# EAGLE schematic Star Motherboard V4 (EAGLE 9.6.2)

## Sheet 1 of 8: ICU- LPC1769/ VIN
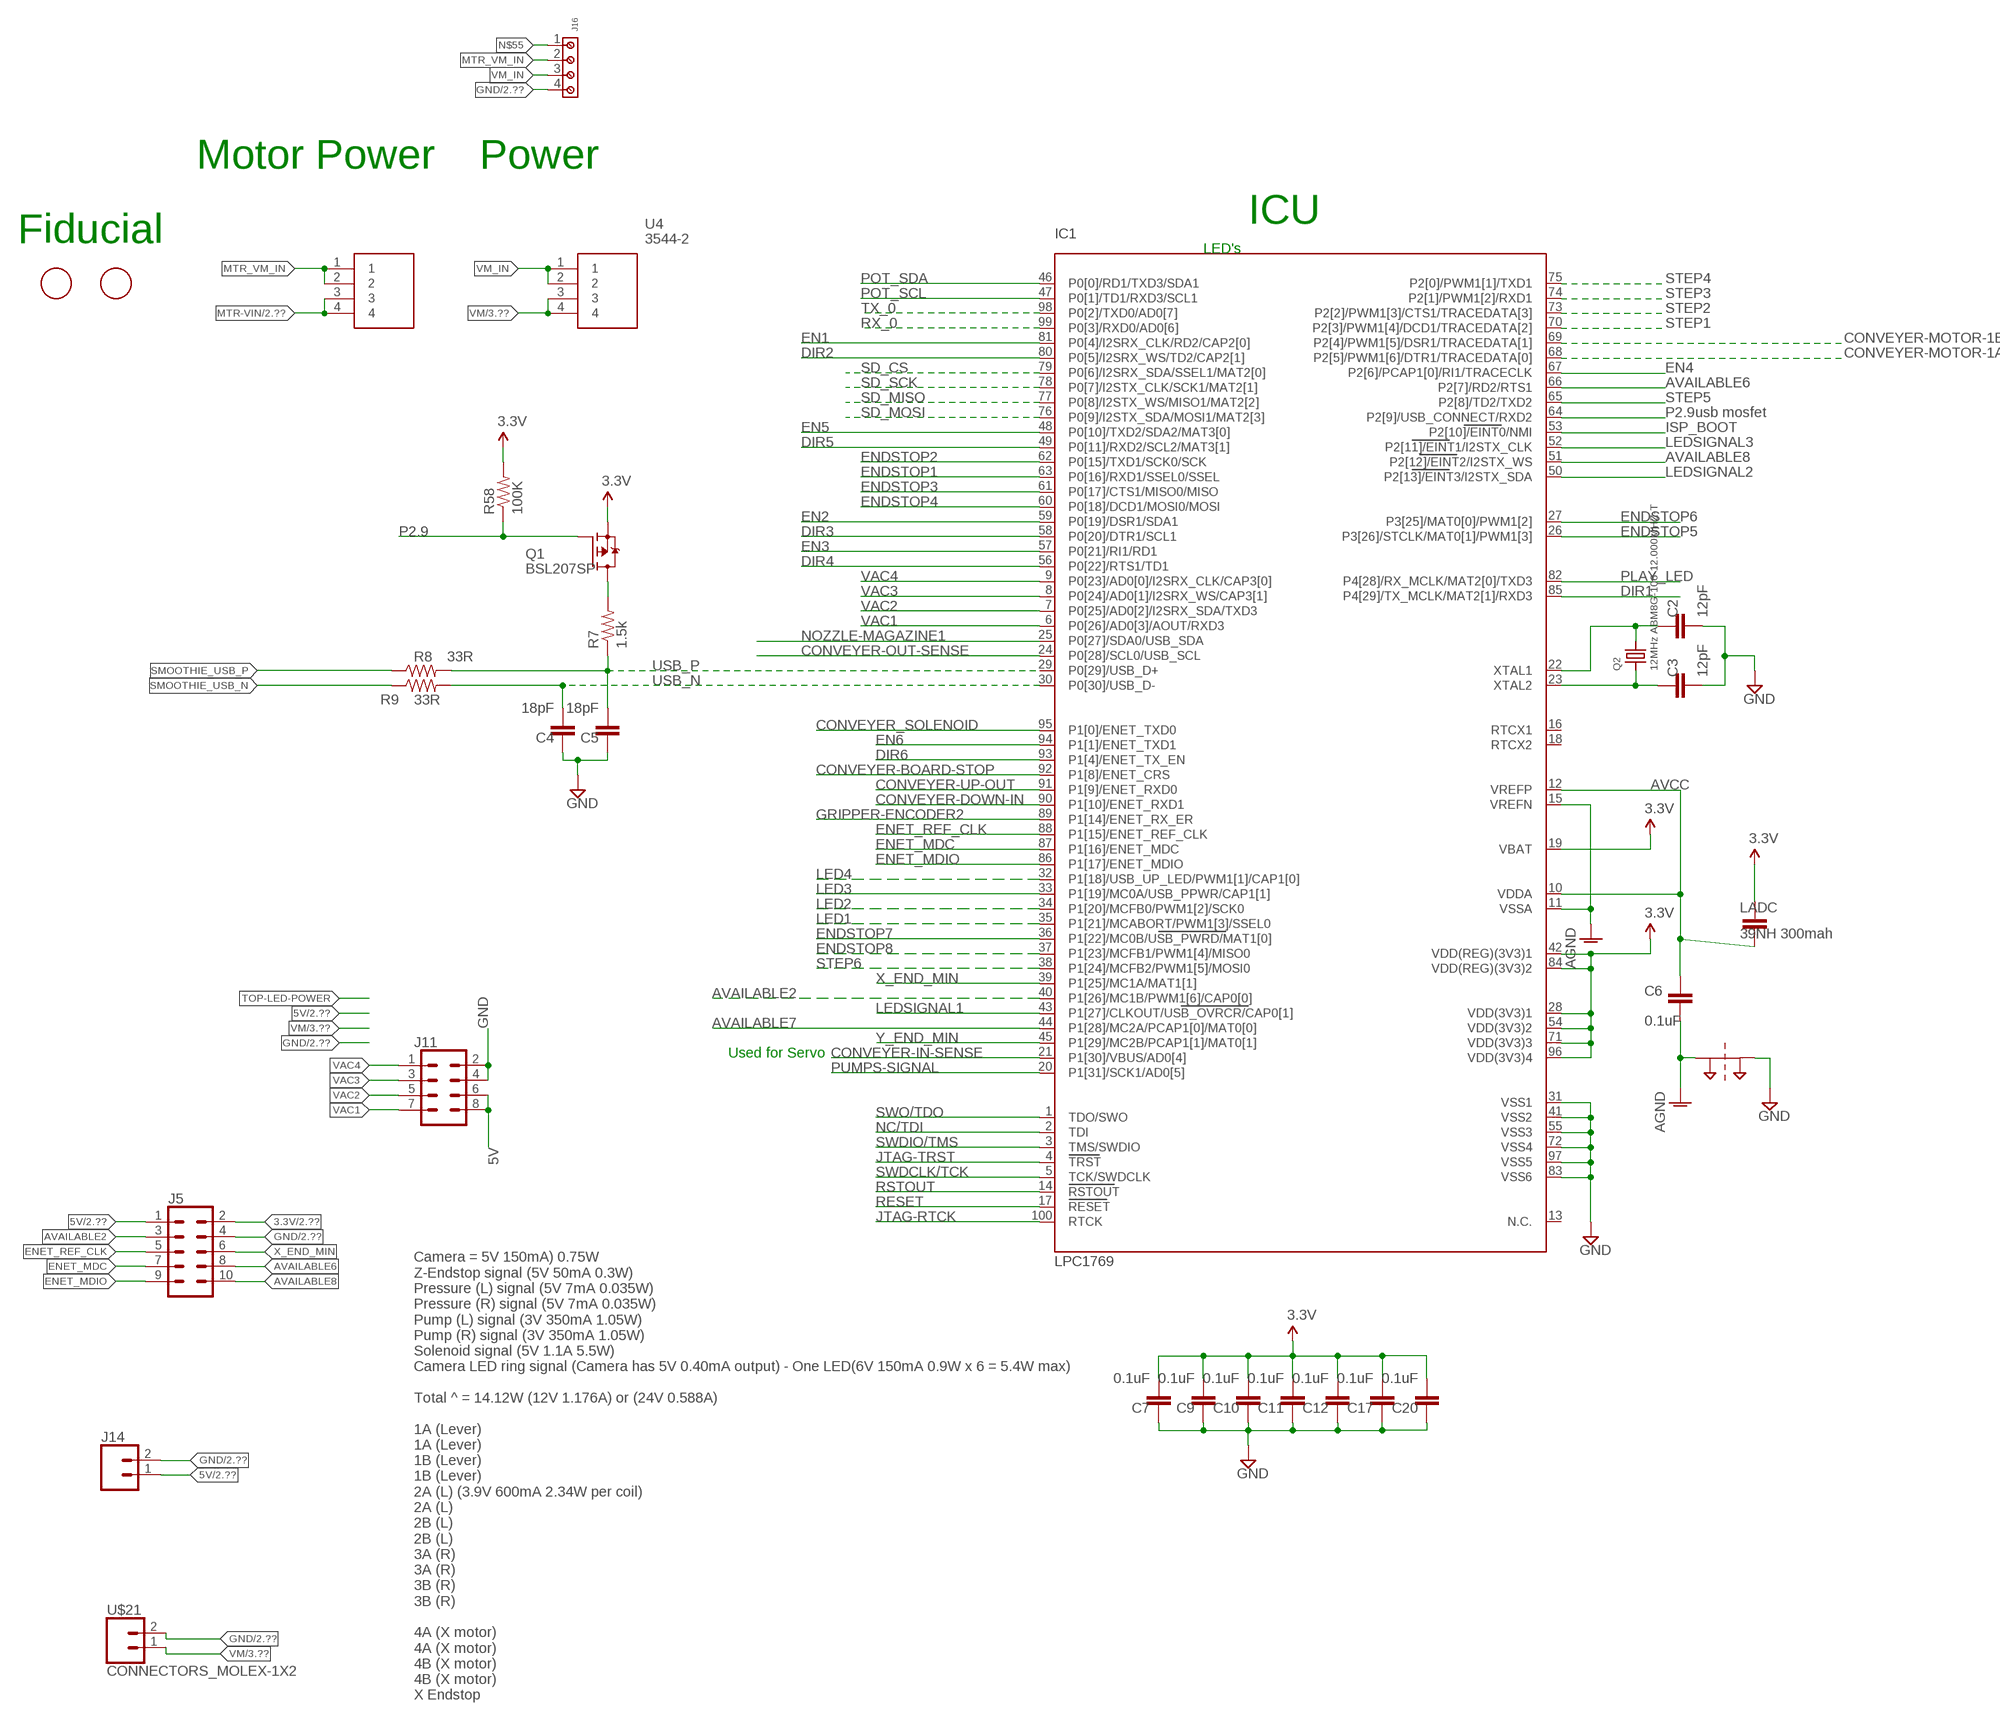
[diagram p0: schematic, sheet 1]

### Parts
C2  12pF  CAP_0603  [CAP_0603]
C3  12pF  CAP_0603  [CAP_0603]
C4  18pF  CAP_0603  [CAP_0603]
C5  18pF  CAP_0603  [CAP_0603]
C6  0.1uF  CAP_0603  [CAP_0603]
C7  0.1uF  CAP_0603  [CAP_0603]
C9  0.1uF  CAP_0603  [CAP_0603]
C10  0.1uF  CAP_0603  [CAP_0603]
C11  0.1uF  CAP_0603  [CAP_0603]
C12  0.1uF  CAP_0603  [CAP_0603]
C17  0.1uF  CAP_0603  [CAP_0603]
C20  0.1uF  CAP_0603  [CAP_0603]
IC1  LPC1769  [LPC1769]
J5  CONN_05X2PTH  [2X5]
J11  CONN_04X2  [2X4]
J14  CONN_02  [1X02]
J16  691137710004  [691137710004]
LADC  39NH 300mah  CAP_0603  [CAP_0603]
Q1  BSL207SP  [SC74_INFINEON]
Q2  12MHz ABM8G-106-12.000MHZ-T  CRYSTALTHIN  [CRYSTAL_3.2X2.5]
R7  1.5k  RESISTOR_0603  [RESISTOR_0603]
R8  33R  RESISTOR_0603  [RESISTOR_0603]
R9  33R  RESISTOR_0603  [RESISTOR_0603]
R58  100K  RESISTOR_0603  [RESISTOR_0603]
SUPPLY10  2PT_GND_TIE  [2PT_GND_TIE]
U1  3544-2  [3544-2]
U4  3544-2  [3544-2]
U$9  FIDUCIAL  [FIDUCIAL_1MM]
U$10  FIDUCIAL  [FIDUCIAL_1MM]
U$21  CONNECTORS_MOLEX-1X2  [CONNECTORS_MOLEX-1X2]

### Nets
3.3V: C7.2 C9.2 C10.2 C11.2 C12.2 C17.2 C20.2 IC1.19(VBAT) IC1.28(VDD(3V3)1) IC1.42(VDD(REG)(3V3)1) IC1.54(VDD(3V3)2) IC1.71(VDD(3V3)3) IC1.84(VDD(REG)(3V3)2) IC1.96(VDD(3V3)4) J5.2 LADC.1 Q1.4(S) R58.2 ; also sheet 2,3,5,6,7
5V: J5.1 J11.6 J11.8 J14.1 ; also sheet 2,3,4,6,7,8
AGND: C6.2 IC1.11(VSSA) IC1.15(VREFN) SUPPLY10.P$1 ; also sheet 6
AVAILABLE2: IC1.40(P1[26]/MC1B/PWM1[6]/CAP0[0]) J5.3
AVAILABLE6: IC1.66(P2[7]/RD2/RTS1) J5.8
AVAILABLE7: IC1.44(P1[28]/MC2A/PCAP1[0]/MAT0[0]) ; also sheet 4
AVAILABLE8: IC1.51(P2[12]/EINT2/I2STX_WS) J5.10
AVCC: C6.1 IC1.10(VDDA) IC1.12(VREFP) LADC.2 ; also sheet 6
CONVEYER-BOARD-STOP: IC1.92(P1[8]/ENET_CRS) ; also sheet 8
CONVEYER-DOWN-IN: IC1.90(P1[10]/ENET_RXD1) ; also sheet 8
CONVEYER-IN-SENSE: IC1.21(P1[30]/VBUS/AD0[4]) ; also sheet 8
CONVEYER-MOTOR-1A: IC1.68(P2[5]/PWM1[6]/DTR1/TRACEDATA[0]) ; also sheet 8
CONVEYER-MOTOR-1B: IC1.69(P2[4]/PWM1[5]/DSR1/TRACEDATA[1]) ; also sheet 8
CONVEYER-OUT-SENSE: IC1.24(P0[28]/SCL0/USB_SCL) ; also sheet 8
CONVEYER-UP-OUT: IC1.91(P1[9]/ENET_RXD0) ; also sheet 8
CONVEYER_SOLENOID: IC1.95(P1[0]/ENET_TXD0) ; also sheet 4
DIR1: IC1.85(P4[29]/TX_MCLK/MAT2[1]/RXD3) ; also sheet 2
DIR2: IC1.80(P0[5]/I2SRX_WS/TD2/CAP2[1]) ; also sheet 2
DIR3: IC1.58(P0[20]/DTR1/SCL1) ; also sheet 2
DIR4: IC1.56(P0[22]/RTS1/TD1) ; also sheet 2
DIR5: IC1.49(P0[11]/RXD2/SCL2/MAT3[1]) ; also sheet 2
DIR6: IC1.93(P1[4]/ENET_TX_EN) ; also sheet 2
EN1: IC1.81(P0[4]/I2SRX_CLK/RD2/CAP2[0]) ; also sheet 2
EN2: IC1.59(P0[19]/DSR1/SDA1) ; also sheet 2
EN3: IC1.57(P0[21]/RI1/RD1) ; also sheet 2
EN4: IC1.67(P2[6]/PCAP1[0]/RI1/TRACECLK) ; also sheet 2
EN5: IC1.48(P0[10]/TXD2/SDA2/MAT3[0]) ; also sheet 2
EN6: IC1.94(P1[1]/ENET_TXD1) ; also sheet 2
ENDSTOP1: IC1.63(P0[16]/RXD1/SSEL0/SSEL) ; also sheet 6
ENDSTOP2: IC1.62(P0[15]/TXD1/SCK0/SCK) ; also sheet 6
ENDSTOP3: IC1.61(P0[17]/CTS1/MISO0/MISO) ; also sheet 6
ENDSTOP4: IC1.60(P0[18]/DCD1/MOSI0/MOSI) ; also sheet 6
ENDSTOP5: IC1.26(P3[26]/STCLK/MAT0[1]/PWM1[3]) ; also sheet 6
ENDSTOP6: IC1.27(P3[25]/MAT0[0]/PWM1[2]) ; also sheet 6
ENDSTOP7: IC1.36(P1[22]/MC0B/USB_PWRD/MAT1[0]) ; also sheet 6
ENDSTOP8: IC1.37(P1[23]/MCFB1/PWM1[4]/MISO0) ; also sheet 6
ENET_MDC: IC1.87(P1[16]/ENET_MDC) J5.7
ENET_MDIO: IC1.86(P1[17]/ENET_MDIO) J5.9
ENET_REF_CLK: IC1.88(P1[15]/ENET_REF_CLK) J5.5
GND: C2.2 C3.2 C4.1 C5.1 C7.1 C9.1 C10.1 C11.1 C12.1 C17.1 C20.1 IC1.31(VSS1) IC1.41(VSS2) IC1.55(VSS3) IC1.72(VSS4) IC1.83(VSS6) IC1.97(VSS5) J5.4 J11.2 J11.4 J14.2 J16.4 SUPPLY10.P$2 U$21.2 ; also sheet 2,3,4,5,6,7,8
GRIPPER-ENCODER2: IC1.89(P1[14]/ENET_RX_ER) ; also sheet 8
ISP_BOOT: IC1.53(P2[10]/EINT0/NMI) ; also sheet 5
JTAG-RTCK: IC1.100(RTCK)
JTAG-TRST: IC1.4(TRST)
LED1: IC1.35(P1[21]/MCABORT/PWM1[3]/SSEL0) ; also sheet 6
LED2: IC1.34(P1[20]/MCFB0/PWM1[2]/SCK0) ; also sheet 6
LED3: IC1.33(P1[19]/MC0A/USB_PPWR/CAP1[1]) ; also sheet 6
LED4: IC1.32(P1[18]/USB_UP_LED/PWM1[1]/CAP1[0]) ; also sheet 6
LEDSIGNAL1: IC1.43(P1[27]/CLKOUT/USB_OVRCR/CAP0[1]) ; also sheet 4
LEDSIGNAL2: IC1.50(P2[13]/EINT3/I2STX_SDA) ; also sheet 4
LEDSIGNAL3: IC1.52(P2[11]/EINT1/I2STX_CLK) ; also sheet 4
MTR-VIN: U1.3 U1.4 ; also sheet 2
MTR_VM_IN: J16.2 U1.1 U1.2
N$1: C2.1 IC1.22(XTAL1) Q2.2
N$2: C3.1 IC1.23(XTAL2) Q2.1
N$51: Q1.1(D) Q1.2(D) Q1.5(D) Q1.6(D) R7.2
N$55: J16.1
NC/TDI: IC1.2(TDI)
NOZZLE-MAGAZINE1: IC1.25(P0[27]/SDA0/USB_SDA) ; also sheet 8
P2.9: IC1.64(P2[9]/USB_CONNECT/RXD2) Q1.3(G) R58.1
PLAY_LED: IC1.82(P4[28]/RX_MCLK/MAT2[0]/TXD3) ; also sheet 6
POT_SCL: IC1.47(P0[1]/TD1/RXD3/SCL1) ; also sheet 2
POT_SDA: IC1.46(P0[0]/RD1/TXD3/SDA1) ; also sheet 2
PUMPS-SIGNAL: IC1.20(P1[31]/SCK1/AD0[5]) ; also sheet 4
RESET: IC1.17(RESET) ; also sheet 5
RSTOUT: IC1.14(RSTOUT)
RX_0: IC1.99(P0[3]/RXD0/AD0[6]) ; also sheet 5
SD_CS: IC1.79(P0[6]/I2SRX_SDA/SSEL1/MAT2[0]) ; also sheet 5
SD_MISO: IC1.77(P0[8]/I2STX_WS/MISO1/MAT2[2]) ; also sheet 5
SD_MOSI: IC1.76(P0[9]/I2STX_SDA/MOSI1/MAT2[3]) ; also sheet 5
SD_SCK: IC1.78(P0[7]/I2STX_CLK/SCK1/MAT2[1]) ; also sheet 5
SMOOTHIE_USB_N [DP/DM]: R9.1 ; also sheet 7
SMOOTHIE_USB_P [DP/DM]: R8.1 ; also sheet 7
STEP1: IC1.70(P2[3]/PWM1[4]/DCD1/TRACEDATA[2]) ; also sheet 2
STEP2: IC1.73(P2[2]/PWM1[3]/CTS1/TRACEDATA[3]) ; also sheet 2
STEP3: IC1.74(P2[1]/PWM1[2]/RXD1) ; also sheet 2
STEP4: IC1.75(P2[0]/PWM1[1]/TXD1) ; also sheet 2
STEP5: IC1.65(P2[8]/TD2/TXD2) ; also sheet 2
STEP6: IC1.38(P1[24]/MCFB2/PWM1[5]/MOSI0) ; also sheet 2
SWDCLK/TCK: IC1.5(TCK/SWDCLK)
SWDIO/TMS: IC1.3(TMS/SWDIO)
SWO/TDO: IC1.1(TDO/SWO)
TX_0: IC1.98(P0[2]/TXD0/AD0[7]) ; also sheet 5
USB_N [DP/DM]: C4.2 IC1.30(P0[30]/USB_D-) R9.2
USB_P [DP/DM]: C5.2 IC1.29(P0[29]/USB_D+) R7.1 R8.2
VAC1: IC1.6(P0[26]/AD0[3]/AOUT/RXD3) J11.7 ; also sheet 6
VAC2: IC1.7(P0[25]/AD0[2]/I2SRX_SDA/TXD3) J11.5 ; also sheet 6
VAC3: IC1.8(P0[24]/AD0[1]/I2SRX_WS/CAP3[1]) J11.3 ; also sheet 6
VAC4: IC1.9(P0[23]/AD0[0]/I2SRX_CLK/CAP3[0]) J11.1 ; also sheet 6
VM: U4.3 U4.4 U$21.1 ; also sheet 3,4
VM_IN: J16.3 U4.1 U4.2
X_END_MIN: IC1.39(P1[25]/MC1A/MAT1[1]) J5.6
Y_END_MIN: IC1.45(P1[29]/MC2B/PCAP1[1]/MAT0[1]) ; also sheet 4
Unconnected: IC1.13(N.C.) IC1.16(RTCX1) IC1.18(RTCX2)

### Notes on the sheet
- Motor Power | Power
- ICU
- Fiducial
- LED's
- usb mosfet
- Used for Servo
- Camera = 5V 150mA) 0.75W
  Z-Endstop signal (5V 50mA 0.3W)
  Pressure (L) signal (5V 7mA 0.035W)
  Pressure (R) signal (5V 7mA 0.035W)
  Pump (L) signal (3V 350mA 1.05W)
  Pump (R) signal (3V 350mA 1.05W)
  Solenoid signal (5V 1.1A 5.5W)
  Camera LED ring signal (Camera has 5V 0.40mA output) - One LED(6V 150mA 0.9W x 6 = 5.4W max)
  
  Total ^ = 14.12W (12V 1.176A) or (24V 0.588A)
  
  1A (Lever)
  1A (Lever)
  1B (Lever)
  1B (Lever)
  2A (L) (3.9V 600mA 2.34W per coil)
  2A (L)
  2B (L)
  2B (L)
  3A (R)
  3A (R)
  3B (R)
  3B (R)
  
  4A (X motor)
  4A (X motor)
  4B (X motor)
  4B (X motor)
  X Endstop

## Sheet 2 of 8: Trinamic/TMC 2208 Motor Drivers
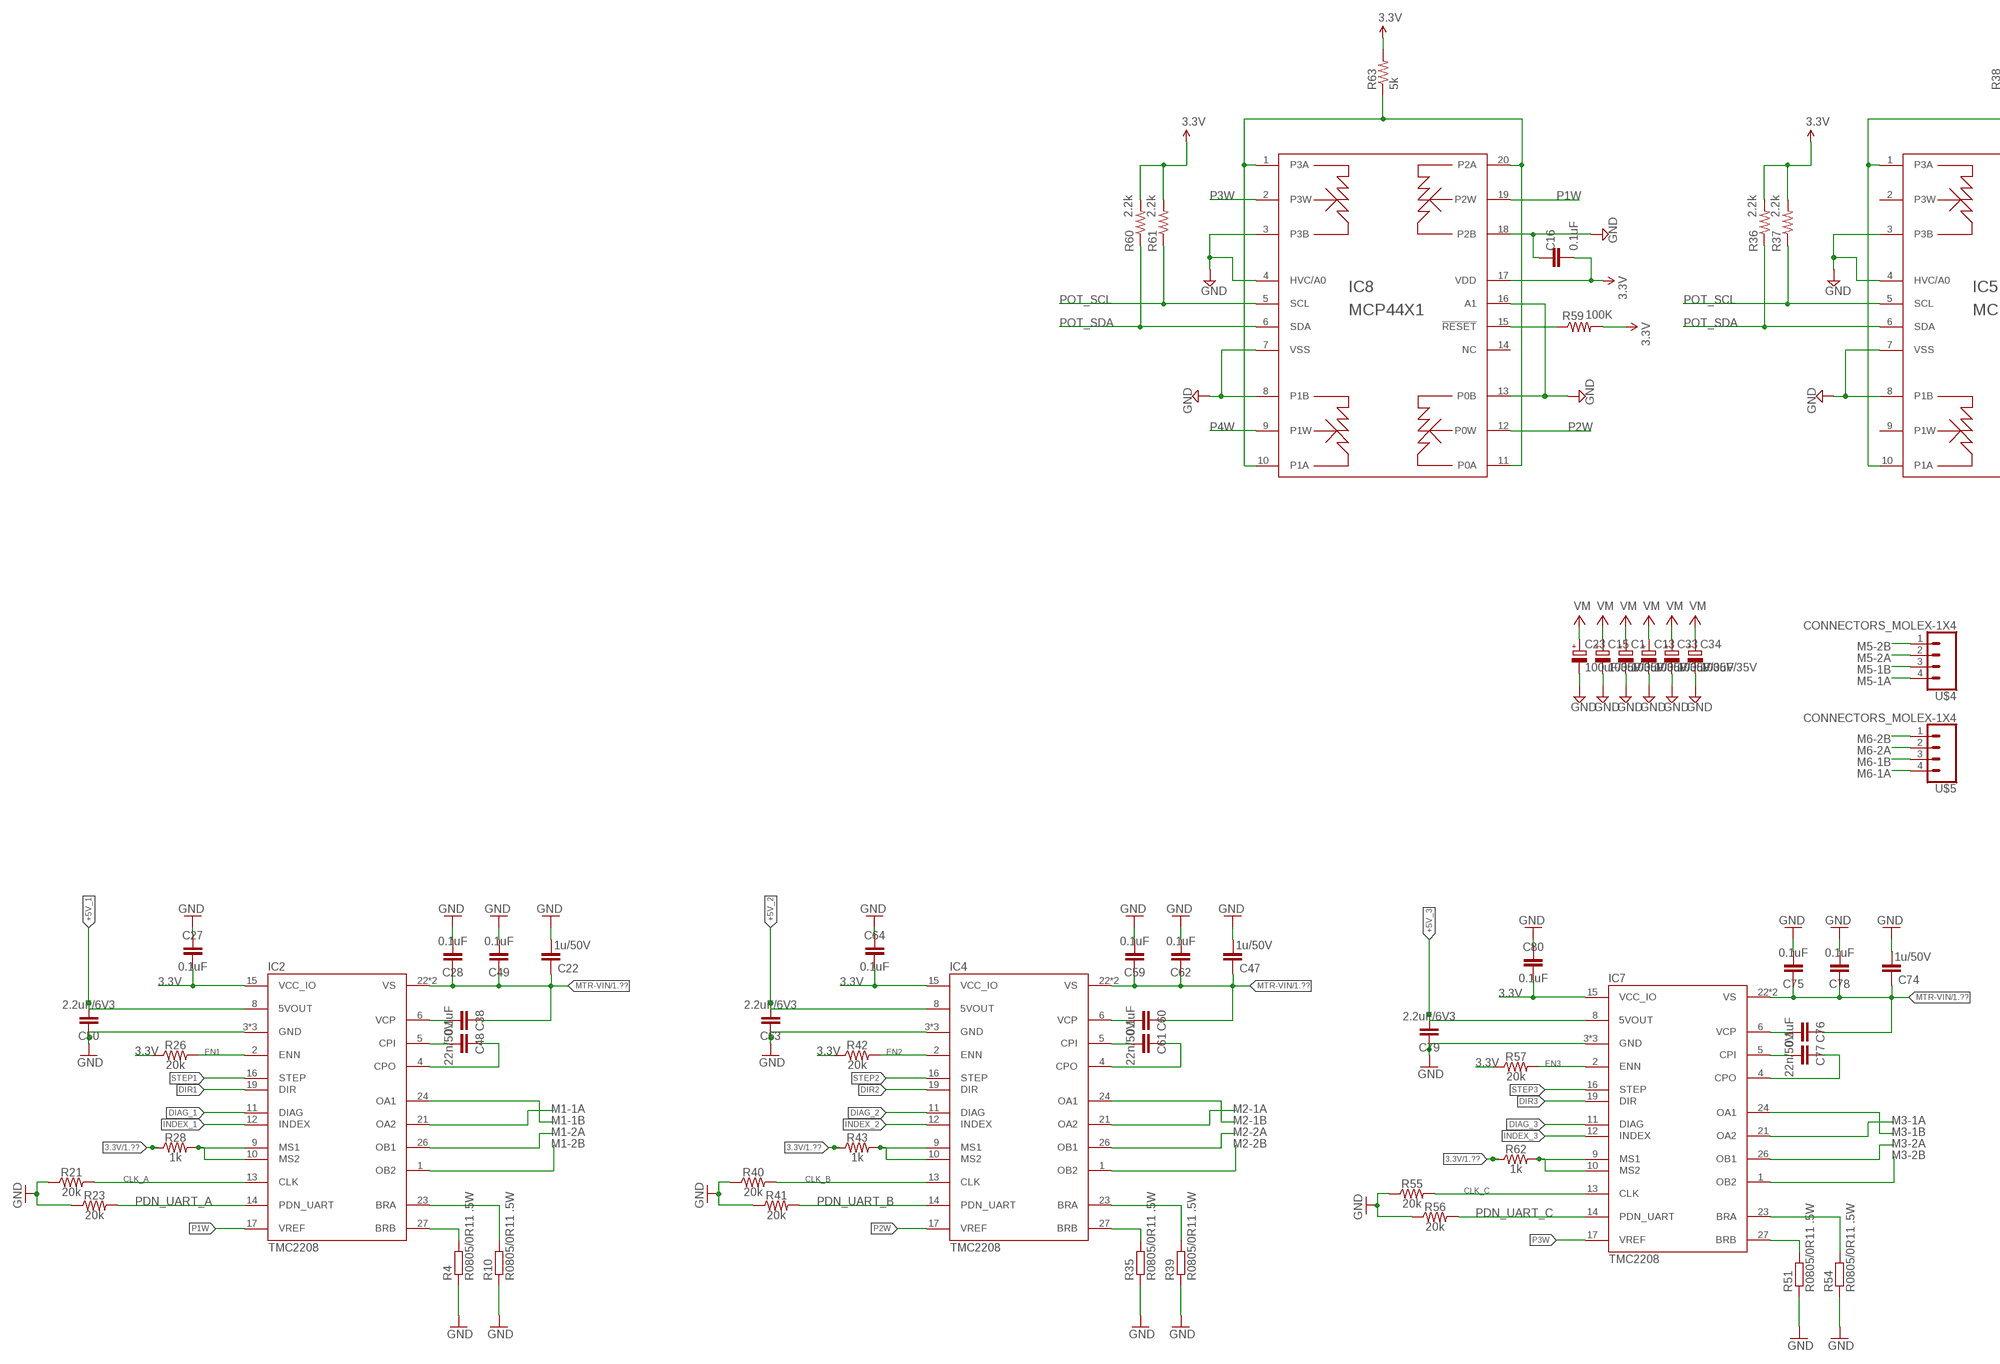
[diagram p1: schematic, sheet 2, part 1 of 2]
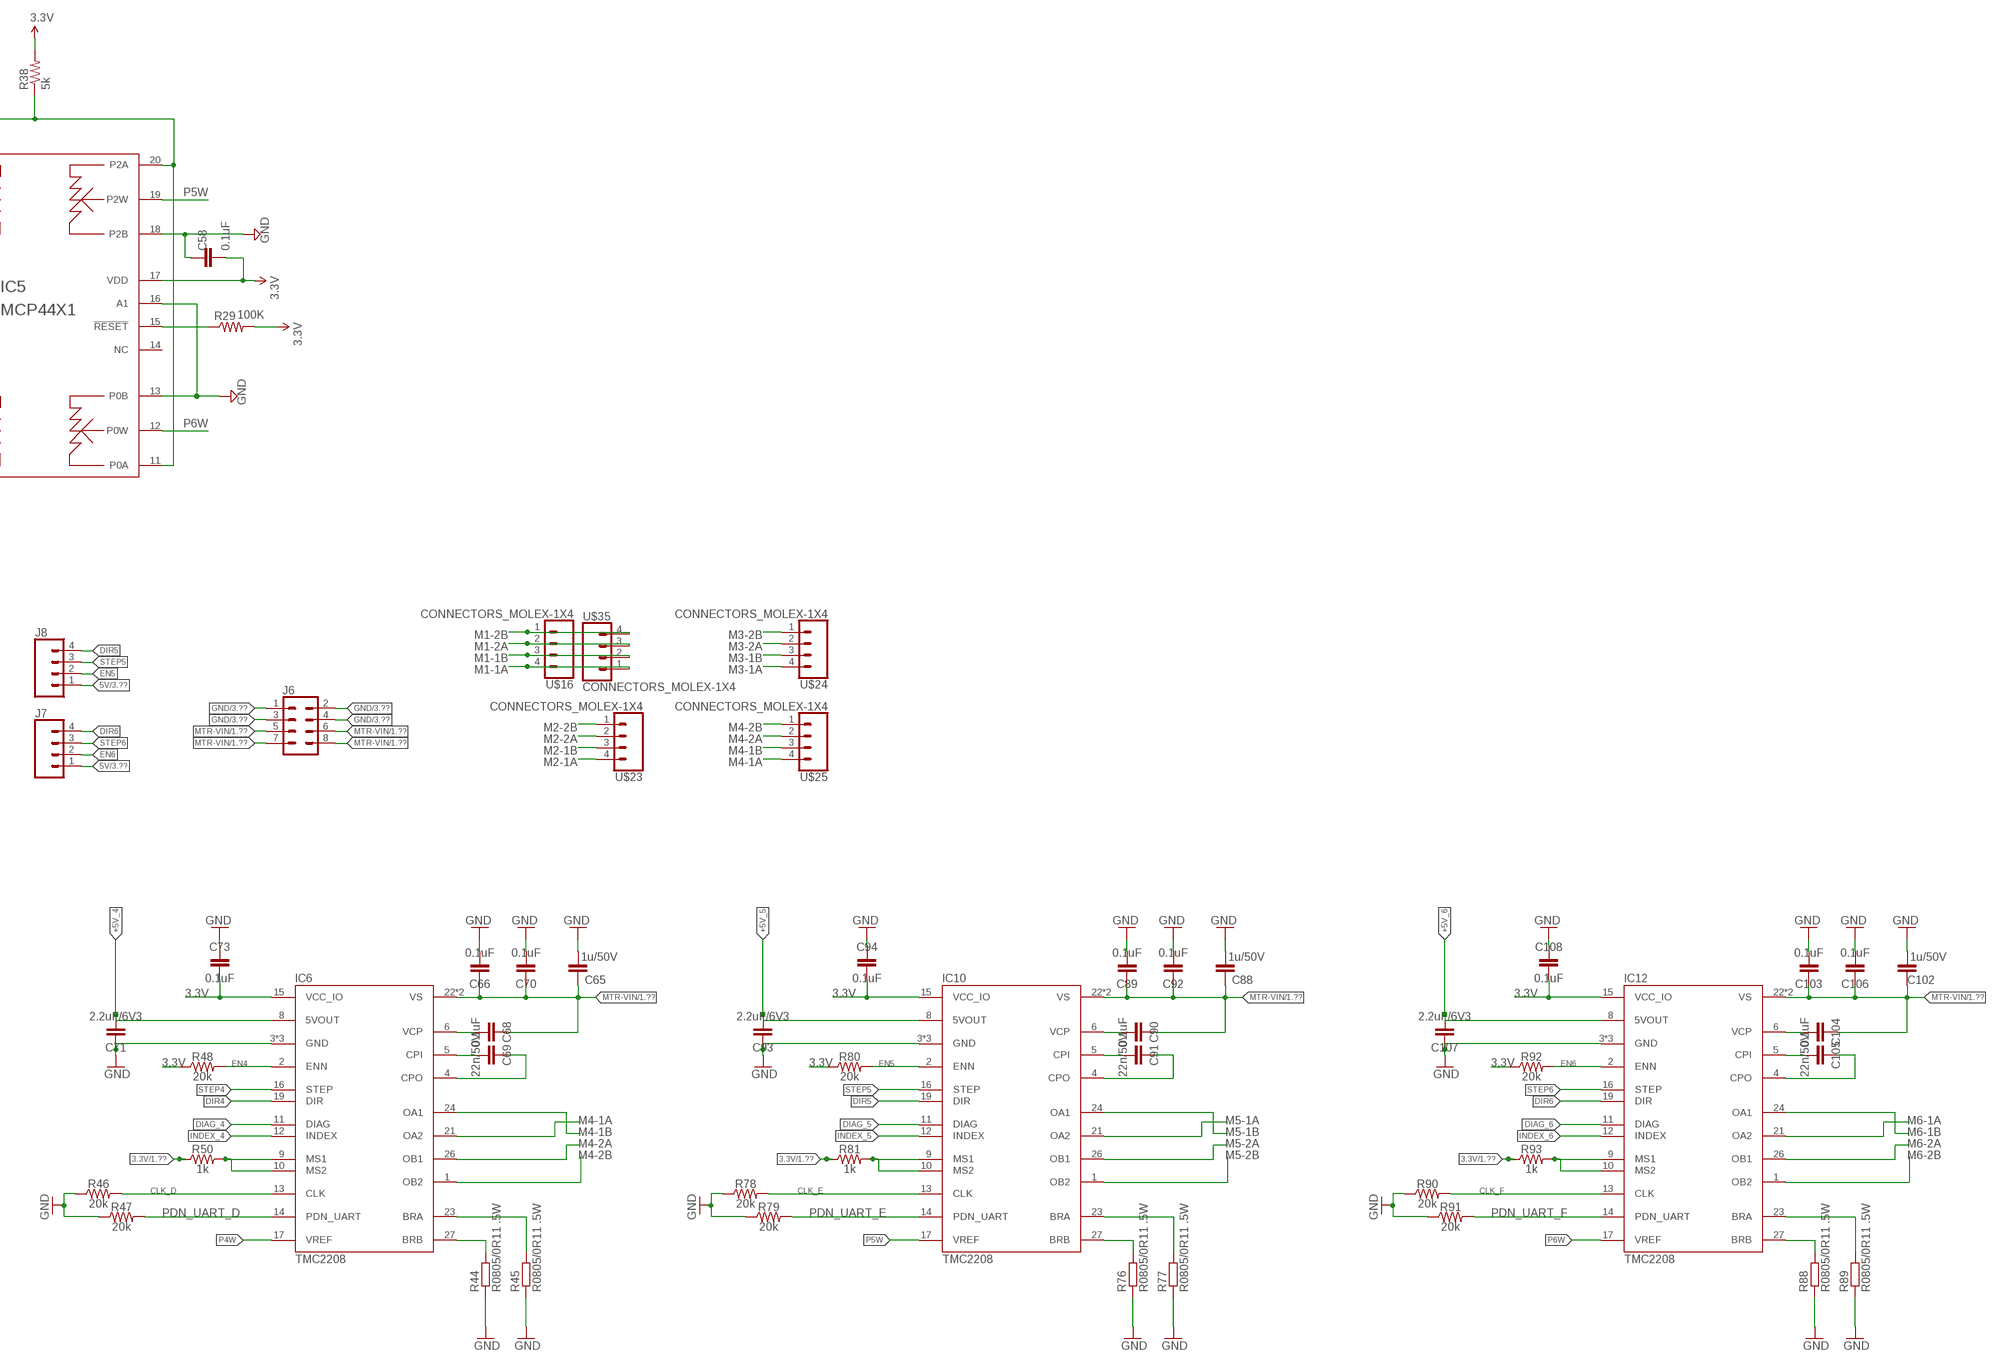
[diagram p2: schematic, sheet 2, part 2 of 2]

### Parts
C1  100uF/35V  CPOL-EU153CLV-0605  [153CLV-0605]
C13  100uF/35V  CPOL-EU153CLV-0605  [153CLV-0605]
C15  100uF/35V  CPOL-EU153CLV-0605  [153CLV-0605]
C16  0.1uF  CAP_0603  [CAP_0603]
C22  1u/50V  C-EUC0805  [C0805]
C23  100uF/35V  CPOL-EU153CLV-0605  [153CLV-0605]
C27  0.1uF  CAP_0603  [CAP_0603]
C28  0.1uF  CAP_0603  [CAP_0603]
C33  100uF/35V  CPOL-EU153CLV-0605  [153CLV-0605]
C34  100uF/35V  CPOL-EU153CLV-0605  [153CLV-0605]
C38  0.1uF  CAP_0603  [CAP_0603]
C47  1u/50V  C-EUC0805  [C0805]
C48  22n/50V  CAP_0603  [CAP_0603]
C49  0.1uF  CAP_0603  [CAP_0603]
C50  2.2uF/6V3  CAP_0603  [CAP_0603]
C58  0.1uF  CAP_0603  [CAP_0603]
C59  0.1uF  CAP_0603  [CAP_0603]
C60  0.1uF  CAP_0603  [CAP_0603]
C61  22n/50V  CAP_0603  [CAP_0603]
C62  0.1uF  CAP_0603  [CAP_0603]
C63  2.2uF/6V3  CAP_0603  [CAP_0603]
C64  0.1uF  CAP_0603  [CAP_0603]
C65  1u/50V  C-EUC0805  [C0805]
C66  0.1uF  CAP_0603  [CAP_0603]
C68  0.1uF  CAP_0603  [CAP_0603]
C69  22n/50V  CAP_0603  [CAP_0603]
C70  0.1uF  CAP_0603  [CAP_0603]
C71  2.2uF/6V3  CAP_0603  [CAP_0603]
C73  0.1uF  CAP_0603  [CAP_0603]
C74  1u/50V  C-EUC0805  [C0805]
C75  0.1uF  CAP_0603  [CAP_0603]
C76  0.1uF  CAP_0603  [CAP_0603]
C77  22n/50V  CAP_0603  [CAP_0603]
C78  0.1uF  CAP_0603  [CAP_0603]
C79  2.2uF/6V3  CAP_0603  [CAP_0603]
C80  0.1uF  CAP_0603  [CAP_0603]
C88  1u/50V  C-EUC0805  [C0805]
C89  0.1uF  CAP_0603  [CAP_0603]
C90  0.1uF  CAP_0603  [CAP_0603]
C91  22n/50V  CAP_0603  [CAP_0603]
C92  0.1uF  CAP_0603  [CAP_0603]
C93  2.2uF/6V3  CAP_0603  [CAP_0603]
C94  0.1uF  CAP_0603  [CAP_0603]
C102  1u/50V  C-EUC0805  [C0805]
C103  0.1uF  CAP_0603  [CAP_0603]
C104  0.1uF  CAP_0603  [CAP_0603]
C105  22n/50V  CAP_0603  [CAP_0603]
C106  0.1uF  CAP_0603  [CAP_0603]
C107  2.2uF/6V3  CAP_0603  [CAP_0603]
C108  0.1uF  CAP_0603  [CAP_0603]
IC2  TMC2208  [QFN28-PAD]
IC4  TMC2208  [QFN28-PAD]
IC5  MCP44X1  [TSSOP20]
IC6  TMC2208  [QFN28-PAD]
IC7  TMC2208  [QFN28-PAD]
IC8  MCP44X1  [TSSOP20]
IC10  TMC2208  [QFN28-PAD]
IC12  TMC2208  [QFN28-PAD]
J6  CONN_04X2  [2X4]
J7  CONN_04  [1X04]
J8  CONN_04  [1X04]
R4  R0805/0R11 .5W  R-EU_R0805  [R0805]
R10  R0805/0R11 .5W  R-EU_R0805  [R0805]
R21  20k  RESISTOR_0603  [RESISTOR_0603]
R23  20k  RESISTOR_0603  [RESISTOR_0603]
R26  20k  RESISTOR_0603  [RESISTOR_0603]
R28  1k  RESISTOR_0603  [RESISTOR_0603]
R29  100K  RESISTOR_0603  [RESISTOR_0603]
R35  R0805/0R11 .5W  R-EU_R0805  [R0805]
R36  2.2k  RESISTOR_0603  [RESISTOR_0603]
R37  2.2k  RESISTOR_0603  [RESISTOR_0603]
R38  5k  RESISTOR_0603  [RESISTOR_0603]
R39  R0805/0R11 .5W  R-EU_R0805  [R0805]
R40  20k  RESISTOR_0603  [RESISTOR_0603]
R41  20k  RESISTOR_0603  [RESISTOR_0603]
R42  20k  RESISTOR_0603  [RESISTOR_0603]
R43  1k  RESISTOR_0603  [RESISTOR_0603]
R44  R0805/0R11 .5W  R-EU_R0805  [R0805]
R45  R0805/0R11 .5W  R-EU_R0805  [R0805]
R46  20k  RESISTOR_0603  [RESISTOR_0603]
R47  20k  RESISTOR_0603  [RESISTOR_0603]
R48  20k  RESISTOR_0603  [RESISTOR_0603]
R50  1k  RESISTOR_0603  [RESISTOR_0603]
R51  R0805/0R11 .5W  R-EU_R0805  [R0805]
R54  R0805/0R11 .5W  R-EU_R0805  [R0805]
R55  20k  RESISTOR_0603  [RESISTOR_0603]
R56  20k  RESISTOR_0603  [RESISTOR_0603]
R57  20k  RESISTOR_0603  [RESISTOR_0603]
R59  100K  RESISTOR_0603  [RESISTOR_0603]
R60  2.2k  RESISTOR_0603  [RESISTOR_0603]
R61  2.2k  RESISTOR_0603  [RESISTOR_0603]
R62  1k  RESISTOR_0603  [RESISTOR_0603]
R63  5k  RESISTOR_0603  [RESISTOR_0603]
R76  R0805/0R11 .5W  R-EU_R0805  [R0805]
R77  R0805/0R11 .5W  R-EU_R0805  [R0805]
R78  20k  RESISTOR_0603  [RESISTOR_0603]
R79  20k  RESISTOR_0603  [RESISTOR_0603]
R80  20k  RESISTOR_0603  [RESISTOR_0603]
R81  1k  RESISTOR_0603  [RESISTOR_0603]
R88  R0805/0R11 .5W  R-EU_R0805  [R0805]
R89  R0805/0R11 .5W  R-EU_R0805  [R0805]
R90  20k  RESISTOR_0603  [RESISTOR_0603]
R91  20k  RESISTOR_0603  [RESISTOR_0603]
R92  20k  RESISTOR_0603  [RESISTOR_0603]
R93  1k  RESISTOR_0603  [RESISTOR_0603]
U$4  CONNECTORS_MOLEX-1X4  [CONNECTORS_MOLEX-1X4]
U$5  CONNECTORS_MOLEX-1X4  [CONNECTORS_MOLEX-1X4]
U$16  CONNECTORS_MOLEX-1X4  [CONNECTORS_MOLEX-1X4]
U$23  CONNECTORS_MOLEX-1X4  [CONNECTORS_MOLEX-1X4]
U$24  CONNECTORS_MOLEX-1X4  [CONNECTORS_MOLEX-1X4]
U$25  CONNECTORS_MOLEX-1X4  [CONNECTORS_MOLEX-1X4]
U$35  CONNECTORS_MOLEX-1X4  [CONNECTORS_MOLEX-1X4]

### Nets
3.3V: C16.2 C27.2 C58.2 C64.2 C73.2 C80.2 C94.2 C108.2 IC2.15(VCC_IO) IC4.15(VCC_IO) IC5.17(VDD) IC6.15(VCC_IO) IC7.15(VCC_IO) IC8.17(VDD) IC10.15(VCC_IO) IC12.15(VCC_IO) R26.1 R28.1 R29.2 R36.2 R37.2 R38.2 R42.1 R43.1 R48.1 R50.1 R57.1 R59.2 R60.2 R61.2 R62.1 R63.2 R80.1 R81.1 R92.1 R93.1 ; also sheet 1,3,5,6,7
5V: J7.1 J8.1 ; also sheet 1,3,4,6,7,8
+5V_1: C50.2 IC2.8(5VOUT)
+5V_2: C63.2 IC4.8(5VOUT)
+5V_3: C79.2 IC7.8(5VOUT)
+5V_4: C71.2 IC6.8(5VOUT)
+5V_5: C93.2 IC10.8(5VOUT)
+5V_6: C107.2 IC12.8(5VOUT)
BRA2: IC2.23(BRA) R10.2
BRA3: IC4.23(BRA) R39.2
BRA4: IC6.23(BRA) R45.2
BRA5: IC7.23(BRA) R54.2
BRA7: IC10.23(BRA) R77.2
BRA9: IC12.23(BRA) R89.2
BRB2: IC2.27(BRB) R4.2
BRB3: IC4.27(BRB) R35.2
BRB4: IC6.27(BRB) R44.2
BRB5: IC7.27(BRB) R51.2
BRB7: IC10.27(BRB) R76.2
BRB9: IC12.27(BRB) R88.2
CLK_A: IC2.13(CLK) R21.2
CLK_B: IC4.13(CLK) R40.2
CLK_C: IC7.13(CLK) R55.2
CLK_D: IC6.13(CLK) R46.2
CLK_E: IC10.13(CLK) R78.2
CLK_F: IC12.13(CLK) R90.2
CPI2: C48.2 IC2.5(CPI)
CPI3: C61.2 IC4.5(CPI)
CPI4: C69.2 IC6.5(CPI)
CPI6: C77.2 IC7.5(CPI)
CPI8: C91.2 IC10.5(CPI)
CPI10: C105.2 IC12.5(CPI)
CPO2: C48.1 IC2.4(CPO)
CPO3: C61.1 IC4.4(CPO)
CPO4: C69.1 IC6.4(CPO)
CPO6: C77.1 IC7.4(CPO)
CPO8: C91.1 IC10.4(CPO)
CPO10: C105.1 IC12.4(CPO)
DIAG_1: IC2.11(DIAG)
DIAG_2: IC4.11(DIAG)
DIAG_3: IC7.11(DIAG)
DIAG_4: IC6.11(DIAG)
DIAG_5: IC10.11(DIAG)
DIAG_6: IC12.11(DIAG)
DIR1: IC2.19(DIR) ; also sheet 1
DIR2: IC4.19(DIR) ; also sheet 1
DIR3: IC7.19(DIR) ; also sheet 1
DIR4: IC6.19(DIR) ; also sheet 1
DIR5: IC10.19(DIR) J8.4 ; also sheet 1
DIR6: IC12.19(DIR) J7.4 ; also sheet 1
EN1: IC2.2(ENN) R26.2 ; also sheet 1
EN2: IC4.2(ENN) R42.2 ; also sheet 1
EN3: IC7.2(ENN) R57.2 ; also sheet 1
EN4: IC6.2(ENN) R48.2 ; also sheet 1
EN5: IC10.2(ENN) J8.2 R80.2 ; also sheet 1
EN6: IC12.2(ENN) J7.2 R92.2 ; also sheet 1
GND: C1.- C13.- C15.- C16.1 C22.2 C23.- C27.1 C28.2 C33.- C34.- C47.2 C49.2 C50.1 C58.1 C59.2 C62.2 C63.1 C64.1 C65.2 C66.2 C70.2 C71.1 C73.1 C74.2 C75.2 C78.2 C79.1 C80.1 C88.2 C89.2 C92.2 C93.1 C94.1 C102.2 C103.2 C106.2 C107.1 C108.1 IC2.3(GND) IC2.18(GND) IC2.TP(GND) IC4.3(GND) IC4.18(GND) IC4.TP(GND) IC5.3(P3B) IC5.4(HVC/A0) IC5.7(VSS) IC5.8(P1B) IC5.13(P0B) IC5.16(A1) IC5.18(P2B) IC6.3(GND) IC6.18(GND) IC6.TP(GND) IC7.3(GND) IC7.18(GND) IC7.TP(GND) IC8.3(P3B) IC8.4(HVC/A0) IC8.7(VSS) IC8.8(P1B) IC8.13(P0B) IC8.16(A1) IC8.18(P2B) IC10.3(GND) IC10.18(GND) IC10.TP(GND) IC12.3(GND) IC12.18(GND) IC12.TP(GND) J6.1 J6.2 J6.3 J6.4 R4.1 R10.1 R21.1 R23.1 R35.1 R39.1 R40.1 R41.1 R44.1 R45.1 R46.1 R47.1 R51.1 R54.1 R55.1 R56.1 R76.1 R77.1 R78.1 R79.1 R88.1 R89.1 R90.1 R91.1 ; also sheet 1,3,4,5,6,7,8
INDEX_1: IC2.12(INDEX)
INDEX_2: IC4.12(INDEX)
INDEX_3: IC7.12(INDEX)
INDEX_4: IC6.12(INDEX)
INDEX_5: IC10.12(INDEX)
INDEX_6: IC12.12(INDEX)
M1-1A: IC2.21(OA2) U$16.4 U$35.1
M1-1B: IC2.24(OA1) U$16.3 U$35.2
M1-2A: IC2.26(OB1) U$16.2 U$35.3
M1-2B: IC2.1(OB2) U$16.1 U$35.4
M2-1A: IC4.21(OA2) U$23.4
M2-1B: IC4.24(OA1) U$23.3
M2-2A: IC4.26(OB1) U$23.2
M2-2B: IC4.1(OB2) U$23.1
M3-1A: IC7.21(OA2) U$24.4
M3-1B: IC7.24(OA1) U$24.3
M3-2A: IC7.26(OB1) U$24.2
M3-2B: IC7.1(OB2) U$24.1
M4-1A: IC6.21(OA2) U$25.4
M4-1B: IC6.24(OA1) U$25.3
M4-2A: IC6.26(OB1) U$25.2
M4-2B: IC6.1(OB2) U$25.1
M5-1A: IC10.21(OA2) U$4.4
M5-1B: IC10.24(OA1) U$4.3
M5-2A: IC10.26(OB1) U$4.2
M5-2B: IC10.1(OB2) U$4.1
M6-1A: IC12.21(OA2) U$5.4
M6-1B: IC12.24(OA1) U$5.3
M6-2A: IC12.26(OB1) U$5.2
M6-2B: IC12.1(OB2) U$5.1
MSX2: IC2.9(MS1) IC2.10(MS2) R28.2
MSX3: IC4.9(MS1) IC4.10(MS2) R43.2
MSX4: IC6.9(MS1) IC6.10(MS2) R50.2
MSX5: IC7.9(MS1) IC7.10(MS2) R62.2
MSX7: IC10.9(MS1) IC10.10(MS2) R81.2
MSX9: IC12.9(MS1) IC12.10(MS2) R93.2
MTR-VIN: C1.+ C13.+ C15.+ C22.1 C23.+ C28.1 C33.+ C34.+ C38.1 C47.1 C49.1 C59.1 C60.1 C62.1 C65.1 C66.1 C68.1 C70.1 C74.1 C75.1 C76.1 C78.1 C88.1 C89.1 C90.1 C92.1 C102.1 C103.1 C104.1 C106.1 IC2.22(VS) IC2.28(VS) IC4.22(VS) IC4.28(VS) IC6.22(VS) IC6.28(VS) IC7.22(VS) IC7.28(VS) IC10.22(VS) IC10.28(VS) IC12.22(VS) IC12.28(VS) J6.5 J6.6 J6.7 J6.8 ; supply symbol labelled VM ; also sheet 1
N$7: IC8.15(!RESET) R59.1
N$14: IC8.1(P3A) IC8.10(P1A) IC8.11(P0A) IC8.20(P2A) R63.1
N$27: IC5.15(!RESET) R29.1
N$30: IC5.1(P3A) IC5.10(P1A) IC5.11(P0A) IC5.20(P2A) R38.1
P1W: IC2.17(VREF) IC8.19(P2W)
P2W: IC4.17(VREF) IC8.12(P0W)
P3W: IC7.17(VREF) IC8.2(P3W)
P4W: IC6.17(VREF) IC8.9(P1W)
P5W: IC5.19(P2W) IC10.17(VREF)
P6W: IC5.12(P0W) IC12.17(VREF)
PDN_UART_A: IC2.14(PDN_UART) R23.2
PDN_UART_B: IC4.14(PDN_UART) R41.2
PDN_UART_C: IC7.14(PDN_UART) R56.2
PDN_UART_D: IC6.14(PDN_UART) R47.2
PDN_UART_E: IC10.14(PDN_UART) R79.2
PDN_UART_F: IC12.14(PDN_UART) R91.2
POT_SCL: IC5.5(SCL) IC8.5(SCL) R37.1 R61.1 ; also sheet 1
POT_SDA: IC5.6(SDA) IC8.6(SDA) R36.1 R60.1 ; also sheet 1
STEP1: IC2.16(STEP) ; also sheet 1
STEP2: IC4.16(STEP) ; also sheet 1
STEP3: IC7.16(STEP) ; also sheet 1
STEP4: IC6.16(STEP) ; also sheet 1
STEP5: IC10.16(STEP) J8.3 ; also sheet 1
STEP6: IC12.16(STEP) J7.3 ; also sheet 1
VCP2: C38.2 IC2.6(VCP)
VCP3: C60.2 IC4.6(VCP)
VCP4: C68.2 IC6.6(VCP)
VCP6: C76.2 IC7.6(VCP)
VCP8: C90.2 IC10.6(VCP)
VCP10: C104.2 IC12.6(VCP)
Unconnected: IC5.2(P3W) IC5.9(P1W) IC5.14(NC) IC8.14(NC)

## Sheet 3 of 8: Buck Regulator/Linear Regulator
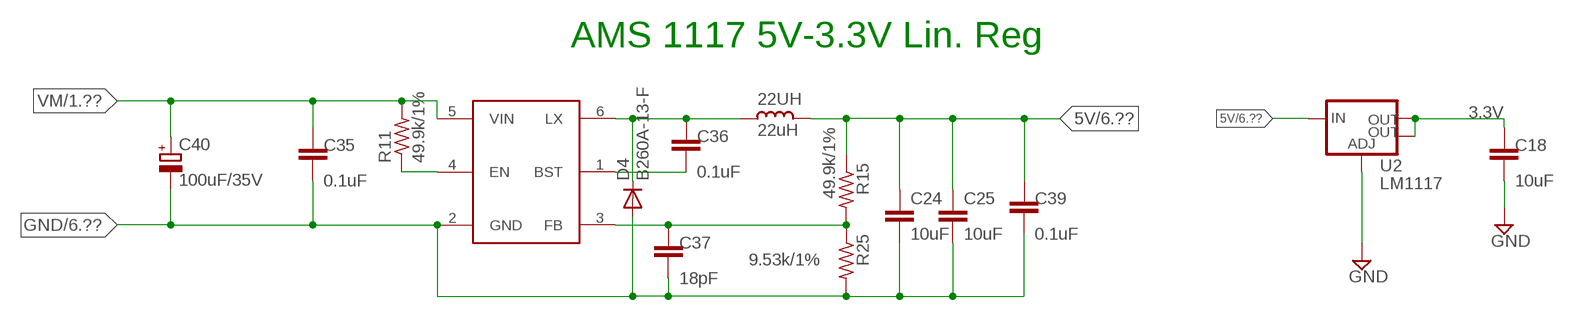
[diagram p3: schematic, sheet 3]

### Parts
22UH  22uH  L_CD75  [CD75]
C18  10uF  CAP_0603  [CAP_0603]
C24  10uF  C-EUC0805  [C0805]
C25  10uF  C-EUC0805  [C0805]
C35  0.1uF  CAP_0603  [CAP_0603]
C36  0.1uF  CAP_0603  [CAP_0603]
C37  18pF  CAP_0603  [CAP_0603]
C39  0.1uF  CAP_0603  [CAP_0603]
C40  100uF/35V  CPOL-EU153CLV-0605  [153CLV-0605]
D4  B260A-13-F  DIODE-DO-214AC  [DO-214AC]
R11  49.9k/1%  RESISTOR_0603  [RESISTOR_0603]
R15  49.9k/1%  RESISTOR_0603  [RESISTOR_0603]
R25  9.53k/1%  RESISTOR_0603  [RESISTOR_0603]
U2  LM1117  V_REG_LM1117SOT223  [SOT223]
U$2  AOZ1282CI  [SOT23-6]

### Nets
3.3V: C18.1 U2.2(OUT) U2.4(OUT) ; also sheet 1,2,5,6,7
5V: 22UH.1 C24.1 C25.1 C39.1 R15.1 U2.3(IN) ; also sheet 1,2,4,6,7,8
GND: C18.2 C24.2 C25.2 C35.2 C37.2 C39.2 C40.- D4.2(A) R25.2 U2.1(ADJ) U$2.2(GND) ; also sheet 1,2,4,5,6,7,8
N$21: R11.1 U$2.4(EN)
N$25: C36.2 U$2.1(BST)
N$28: 22UH.2 C36.1 D4.1(C) U$2.6(LX)
N$29: C37.1 R15.2 R25.1 U$2.3(FB)
VM: C35.1 C40.+ R11.2 U$2.5(VIN) ; also sheet 1,4

### Notes on the sheet
- AMS 1117 5V-3.3V Lin. Reg

## Sheet 4 of 8: Mosfets
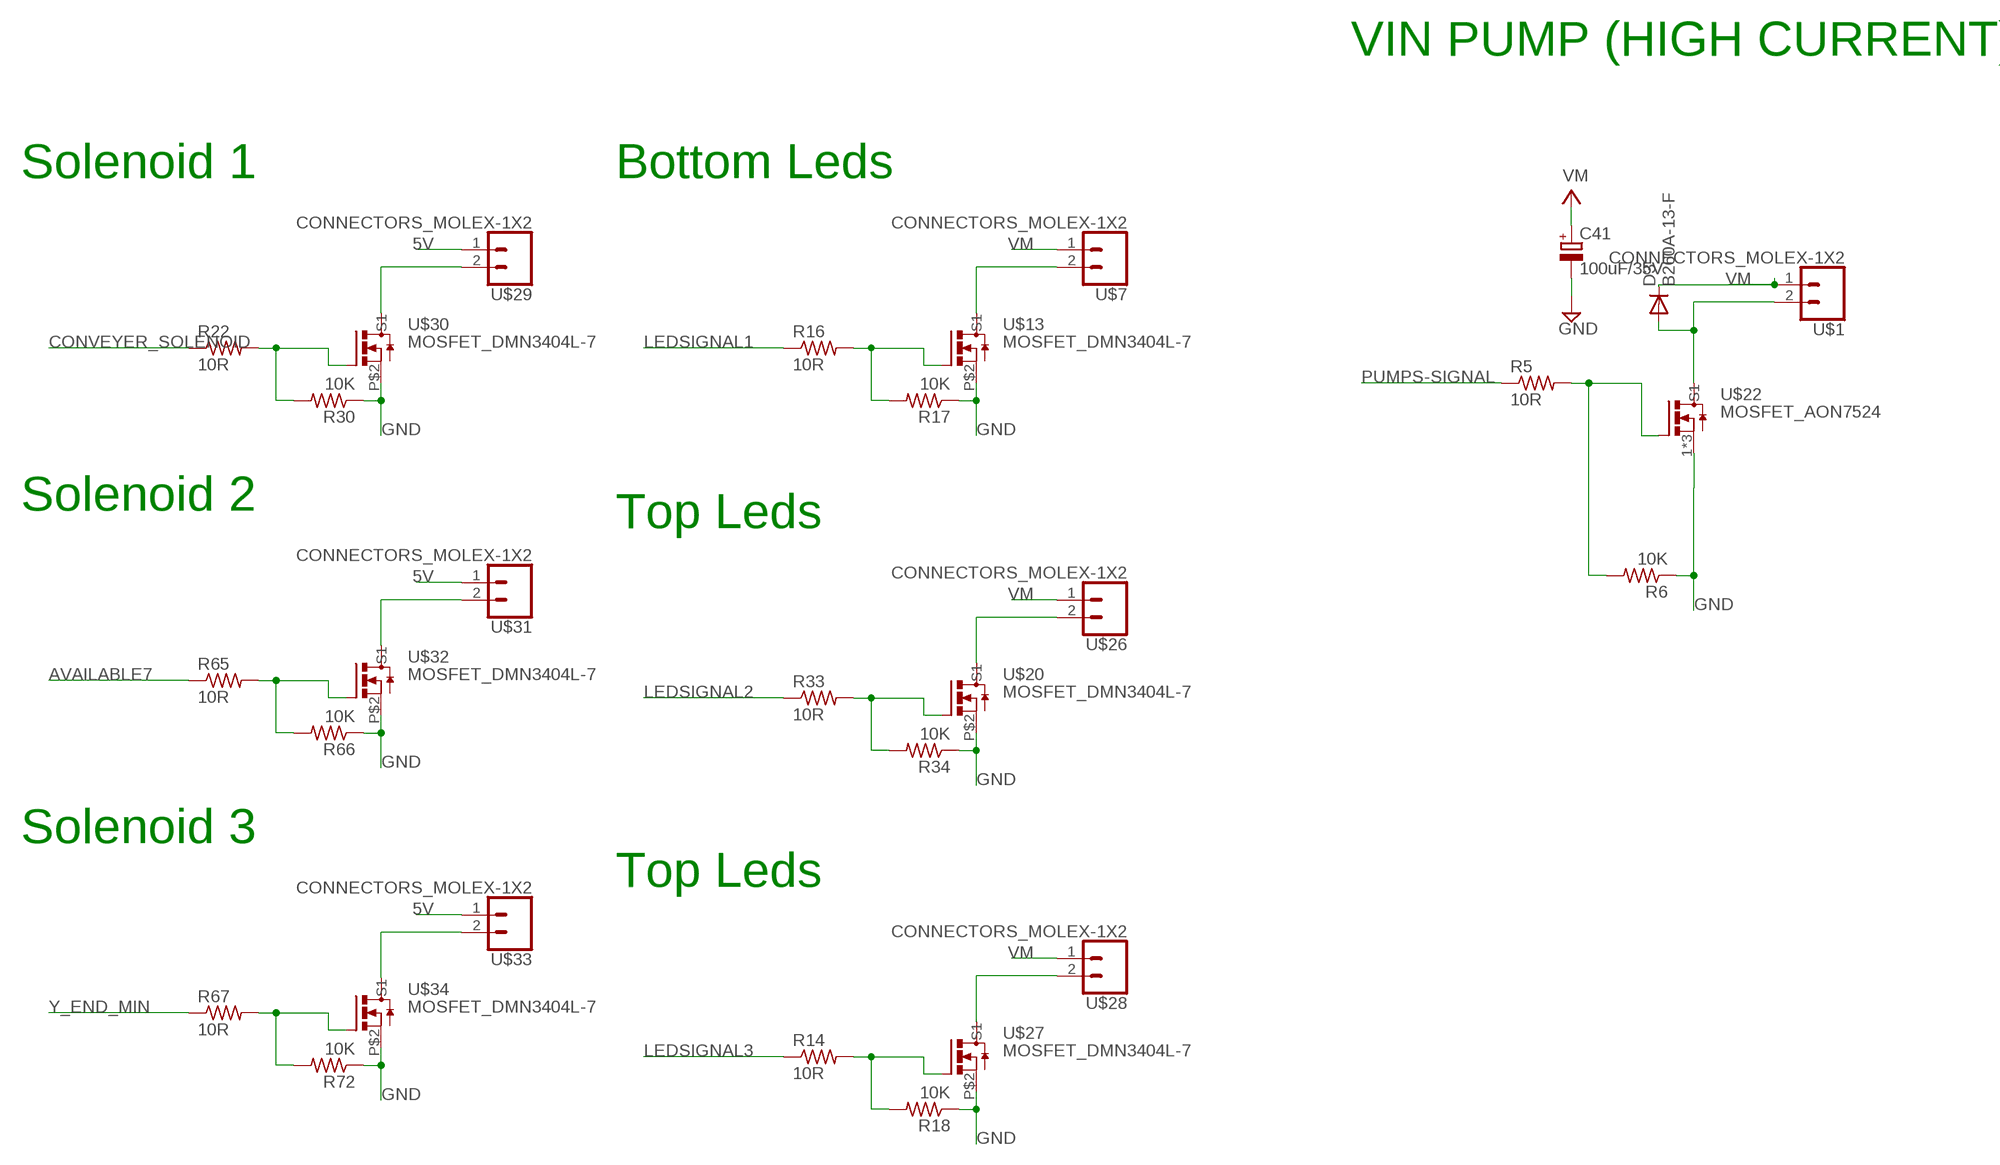
[diagram p4: schematic, sheet 4]

### Parts
C41  100uF/35V  CPOL-EU153CLV-0605  [153CLV-0605]
D3  B260A-13-F  DIODE-DO-214AC  [DO-214AC]
R5  10R  RESISTOR_0603  [RESISTOR_0603]
R6  10K  RESISTOR_0603  [RESISTOR_0603]
R14  10R  RESISTOR_0603  [RESISTOR_0603]
R16  10R  RESISTOR_0603  [RESISTOR_0603]
R17  10K  RESISTOR_0603  [RESISTOR_0603]
R18  10K  RESISTOR_0603  [RESISTOR_0603]
R22  10R  RESISTOR_0603  [RESISTOR_0603]
R30  10K  RESISTOR_0603  [RESISTOR_0603]
R33  10R  RESISTOR_0603  [RESISTOR_0603]
R34  10K  RESISTOR_0603  [RESISTOR_0603]
R65  10R  RESISTOR_0603  [RESISTOR_0603]
R66  10K  RESISTOR_0603  [RESISTOR_0603]
R67  10R  RESISTOR_0603  [RESISTOR_0603]
R72  10K  RESISTOR_0603  [RESISTOR_0603]
U$1  CONNECTORS_MOLEX-1X2  [CONNECTORS_MOLEX-1X2]
U$7  CONNECTORS_MOLEX-1X2  [CONNECTORS_MOLEX-1X2]
U$13  MOSFET_DMN3404L-7  [MOSFET_DMN3404L-7]
U$20  MOSFET_DMN3404L-7  [MOSFET_DMN3404L-7]
U$22  MOSFET_AON7524  [MOSFET_AON7524]
U$26  CONNECTORS_MOLEX-1X2  [CONNECTORS_MOLEX-1X2]
U$27  MOSFET_DMN3404L-7  [MOSFET_DMN3404L-7]
U$28  CONNECTORS_MOLEX-1X2  [CONNECTORS_MOLEX-1X2]
U$29  CONNECTORS_MOLEX-1X2  [CONNECTORS_MOLEX-1X2]
U$30  MOSFET_DMN3404L-7  [MOSFET_DMN3404L-7]
U$31  CONNECTORS_MOLEX-1X2  [CONNECTORS_MOLEX-1X2]
U$32  MOSFET_DMN3404L-7  [MOSFET_DMN3404L-7]
U$33  CONNECTORS_MOLEX-1X2  [CONNECTORS_MOLEX-1X2]
U$34  MOSFET_DMN3404L-7  [MOSFET_DMN3404L-7]

### Nets
5V: U$29.1 U$31.1 U$33.1 ; also sheet 1,2,3,6,7,8
AVAILABLE7: R65.1 ; also sheet 1
CONVEYER_SOLENOID: R22.1 ; also sheet 1
GND: C41.- R6.1 R17.1 R18.1 R30.1 R34.1 R66.1 R72.1 U$13.P$2(S1) U$20.P$2(S1) U$22.1(S1) U$22.2(S1) U$22.3(S1) U$27.P$2(S1) U$30.P$2(S1) U$32.P$2(S1) U$34.P$2(S1) ; also sheet 1,2,3,5,6,7,8
LEDSIGNAL1: R16.1 ; also sheet 1
LEDSIGNAL2: R33.1 ; also sheet 1
LEDSIGNAL3: R14.1 ; also sheet 1
N$3: R16.2 R17.2 U$13.P$3(G1)
N$4: R33.2 R34.2 U$20.P$3(G1)
N$16: R5.2 R6.2 U$22.4(G1)
N$41: R14.2 R18.2 U$27.P$3(G1)
N$42: R22.2 R30.2 U$30.P$3(G1)
N$44: R65.2 R66.2 U$32.P$3(G1)
N$45: R67.2 R72.2 U$34.P$3(G1)
PUMPS-SIGNAL: R5.1 ; also sheet 1
TOP-LED-POWER: U$20.P$1(D1) U$26.2 ; also sheet 1
TOP-LED-POWER1: U$27.P$1(D1) U$28.2
VIBRATOR_FET_CONTROL1: U$7.2 U$13.P$1(D1)
VIBRATOR_FET_CONTROL2: D3.2(A) U$1.2 U$22.5(D1) U$22.6(D1) U$22.7(D1) U$22.8(D1) U$22.9(D1) U$22.10(D1) U$22.11(D1)
VIBRATOR_FET_CONTROL3: U$29.2 U$30.P$1(D1)
VIBRATOR_FET_CONTROL4: U$31.2 U$32.P$1(D1)
VIBRATOR_FET_CONTROL5: U$33.2 U$34.P$1(D1)
VM: C41.+ D3.1(C) U$1.1 U$7.1 U$26.1 U$28.1 ; also sheet 1,3
Y_END_MIN: R67.1 ; also sheet 1

### Notes on the sheet
- VIN PUMP (HIGH CURRENT)
- Solenoid 1 | Bottom Leds
- Solenoid 2
- Top Leds
- Solenoid 3
- Top Leds

## Sheet 5 of 8: SD/EXP/Serial Conn./Switches
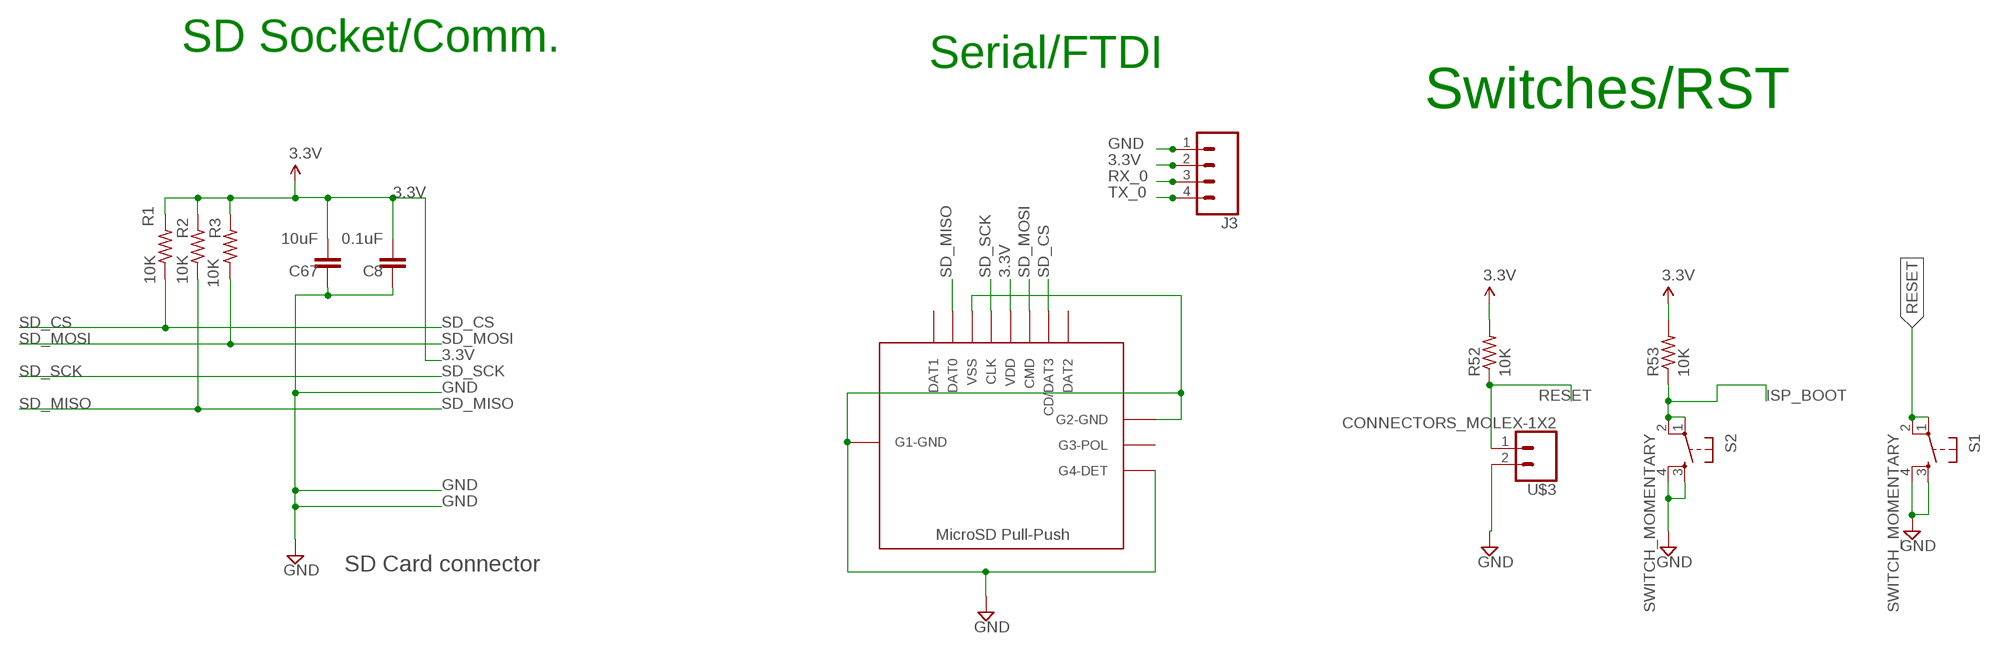
[diagram p5: schematic, sheet 5]

### Parts
C8  0.1uF  CAP_0603  [CAP_0603]
C67  10uF  CAP_0603  [CAP_0603]
J3  CONN_04  [1X04]
R1  10K  RESISTOR_0603  [RESISTOR_0603]
R2  10K  RESISTOR_0603  [RESISTOR_0603]
R3  10K  RESISTOR_0603  [RESISTOR_0603]
R52  10K  RESISTOR_0603  [RESISTOR_0603]
R53  10K  RESISTOR_0603  [RESISTOR_0603]
S1  SWITCH_MOMENTARY  [SWITCH_MOMENTARY]
S2  SWITCH_MOMENTARY  [SWITCH_MOMENTARY]
U$3  CONNECTORS_MOLEX-1X2  [CONNECTORS_MOLEX-1X2]
U$12  MICROSD_PUSH-PULL  [MICROSD_PUSH-PULL]

### Nets
3.3V: C8.2 C67.2 J3.2 R1.2 R2.2 R3.2 R52.2 R53.2 U$12.PIN4(VDD) ; also sheet 1,2,3,6,7
GND: C8.1 C67.1 J3.1 S1.3 S1.4 S2.3 S2.4 U$3.2 U$12.G1(G1-GND) U$12.G2(G2-GND) U$12.G4(G4-DET) U$12.PIN6(VSS) ; also sheet 1,2,3,4,6,7,8
ISP_BOOT: R53.1 S2.1 S2.2 ; also sheet 1
RESET: R52.1 S1.1 S1.2 U$3.1 ; also sheet 1
RX_0: J3.3 ; also sheet 1
SD_CS: R1.1 U$12.PIN2(CD/DAT3) ; also sheet 1
SD_MISO: R2.1 U$12.PIN7(DAT0) ; also sheet 1
SD_MOSI: R3.1 U$12.PIN3(CMD) ; also sheet 1
SD_SCK: U$12.PIN5(CLK) ; also sheet 1
TX_0: J3.4 ; also sheet 1
Unconnected: U$12.G3(G3-POL) U$12.PIN1(DAT2) U$12.PIN8(DAT1)

### Notes on the sheet
- SD Socket/Comm.
- Serial/FTDI
- Switches/RST
- SD Card connector

## Sheet 6 of 8: Endstops/Thermistors/LED's/Buzzer
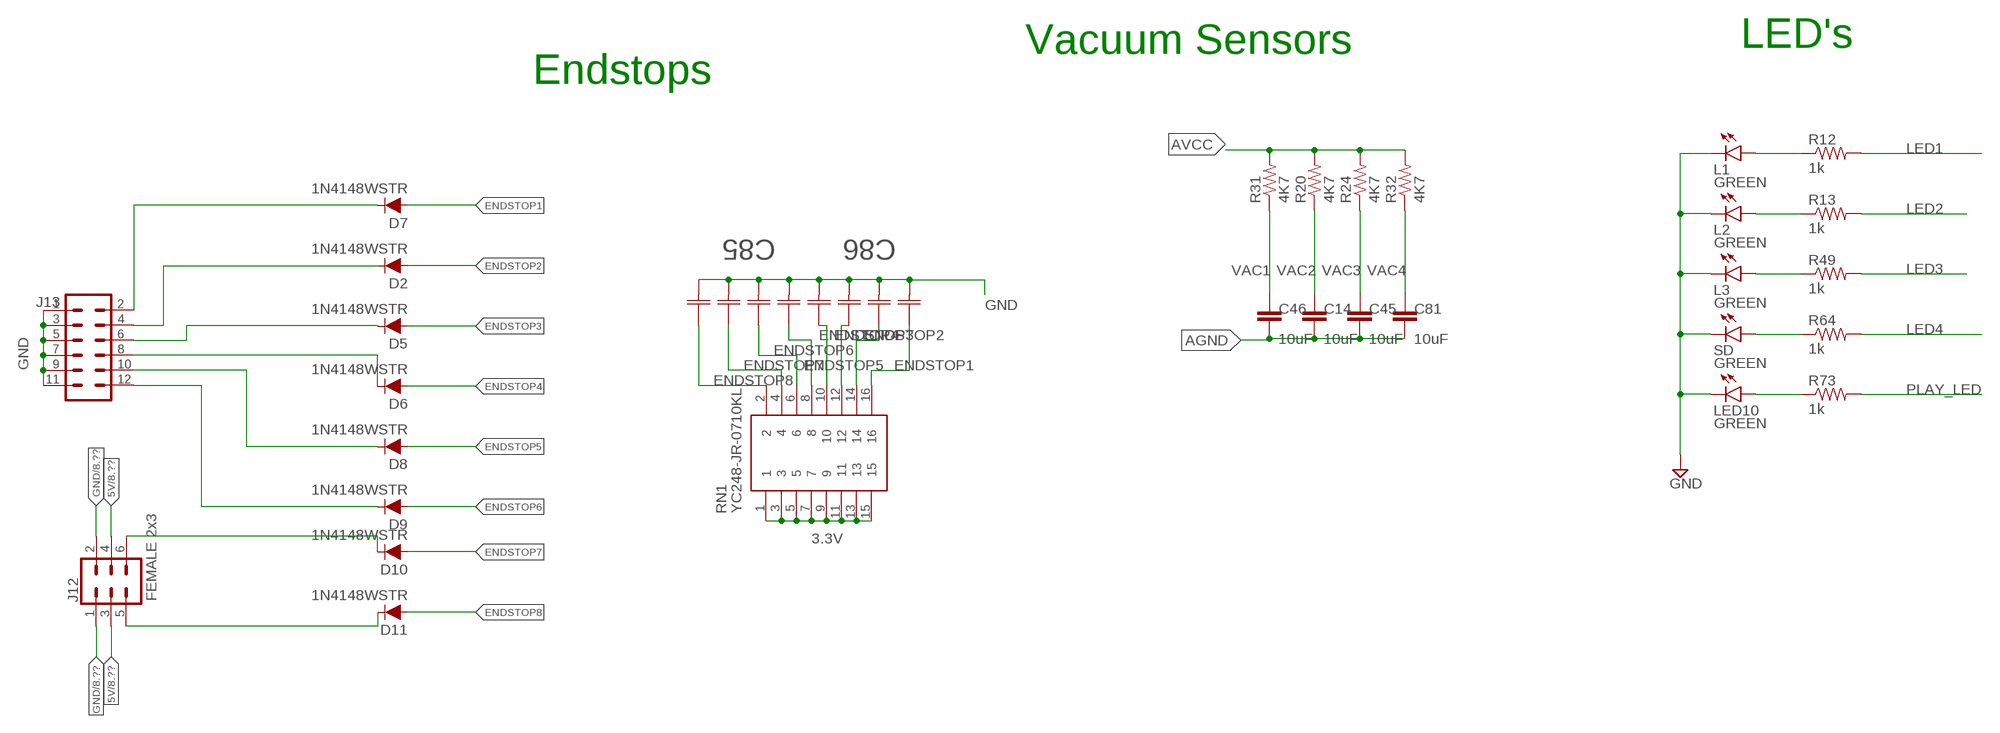
[diagram p6: schematic, sheet 6]

### Parts
C14  10uF  CAP_0603  [CAP_0603]
C45  10uF  CAP_0603  [CAP_0603]
C46  10uF  CAP_0603  [CAP_0603]
C81  10uF  CAP_0603  [CAP_0603]
C85  CAP_ARRAY_CA064C104M4RAC7800  [CA064_KEM]
C86  CAP_ARRAY_CA064C104M4RAC7800  [CA064_KEM]
D2  1N4148WSTR  DIODE-BAS16J  [SOD-323]
D5  1N4148WSTR  DIODE-BAS16J  [SOD-323]
D6  1N4148WSTR  DIODE-BAS16J  [SOD-323]
D7  1N4148WSTR  DIODE-BAS16J  [SOD-323]
D8  1N4148WSTR  DIODE-BAS16J  [SOD-323]
D9  1N4148WSTR  DIODE-BAS16J  [SOD-323]
D10  1N4148WSTR  DIODE-BAS16J  [SOD-323]
D11  1N4148WSTR  DIODE-BAS16J  [SOD-323]
J12  FEMALE 2x3  CONN_03X2FEMALE  [2X3]
J13  2X6 FEMALE  CONN_06X2PTH_FEMALE  [2X6]
L1  GREEN  LED-GREEN0603  [LED-0603]
L2  GREEN  LED0603  [LED-0603]
L3  GREEN  LED0603  [LED-0603]
LED10  GREEN  LED0603  [LED-0603]
R12  1k  RESISTOR_0603  [RESISTOR_0603]
R13  1k  RESISTOR_0603  [RESISTOR_0603]
R20  4K7  RESISTOR_0603  [RESISTOR_0603]
R24  4K7  RESISTOR_0603  [RESISTOR_0603]
R31  4K7  RESISTOR_0603  [RESISTOR_0603]
R32  4K7  RESISTOR_0603  [RESISTOR_0603]
R49  1k  RESISTOR_0603  [RESISTOR_0603]
R64  1k  RESISTOR_0603  [RESISTOR_0603]
R73  1k  RESISTOR_0603  [RESISTOR_0603]
RN1  YC248-JR-0710KL  [YC248JR0710KL]
SD  GREEN  LED0603  [LED-0603]

### Nets
3.3V: RN1.1 RN1.3 RN1.5 RN1.7 RN1.9 RN1.11 RN1.13 RN1.15 ; also sheet 1,2,3,5,7
5V: J12.3 J12.4 ; also sheet 1,2,3,4,7,8
AGND: C14.2 C45.2 C46.2 C81.2 ; also sheet 1
AVCC: R20.2 R24.2 R31.2 R32.2 ; also sheet 1
ENDSTOP1: C86.4 D7.A RN1.16 ; also sheet 1
ENDSTOP2: C86.3 D2.A RN1.14 ; also sheet 1
ENDSTOP3: C86.2 D5.A RN1.12 ; also sheet 1
ENDSTOP4: C86.1 D6.A RN1.10 ; also sheet 1
ENDSTOP5: C85.4 D8.A RN1.8 ; also sheet 1
ENDSTOP6: C85.3 D9.A RN1.6 ; also sheet 1
ENDSTOP7: C85.2 D10.A RN1.4 ; also sheet 1
ENDSTOP8: C85.1 D11.A RN1.2 ; also sheet 1
GND: C85.5 C85.6 C85.7 C85.8 C86.5 C86.6 C86.7 C86.8 J12.1 J12.2 J13.1 J13.3 J13.5 J13.7 J13.9 J13.11 L1.C L2.C L3.C LED10.C SD.C ; also sheet 1,2,3,4,5,7,8
LED1: R12.2 ; also sheet 1
LED2: R13.2 ; also sheet 1
LED3: R49.2 ; also sheet 1
LED4: R64.2 ; also sheet 1
N$20: D7.C J13.2
N$23: D2.C J13.4
N$24: D5.C J13.6
N$26: D6.C J13.8
N$32: D8.C J13.10
N$34: LED10.A R73.1
N$39: D10.C J12.6
N$40: D11.C J12.5
N$58: D9.C J13.12
N$84: R64.1 SD.A
N$85: L3.A R49.1
N$86: L2.A R13.1
N$87: L1.A R12.1
PLAY_LED: R73.2 ; also sheet 1
VAC1: C46.1 R31.1 ; also sheet 1
VAC2: C14.1 R20.1 ; also sheet 1
VAC3: C45.1 R24.1 ; also sheet 1
VAC4: C81.1 R32.1 ; also sheet 1

### Notes on the sheet
- Vacuum Sensors | LED's
- Endstops

## Sheet 7 of 8: USB Hub
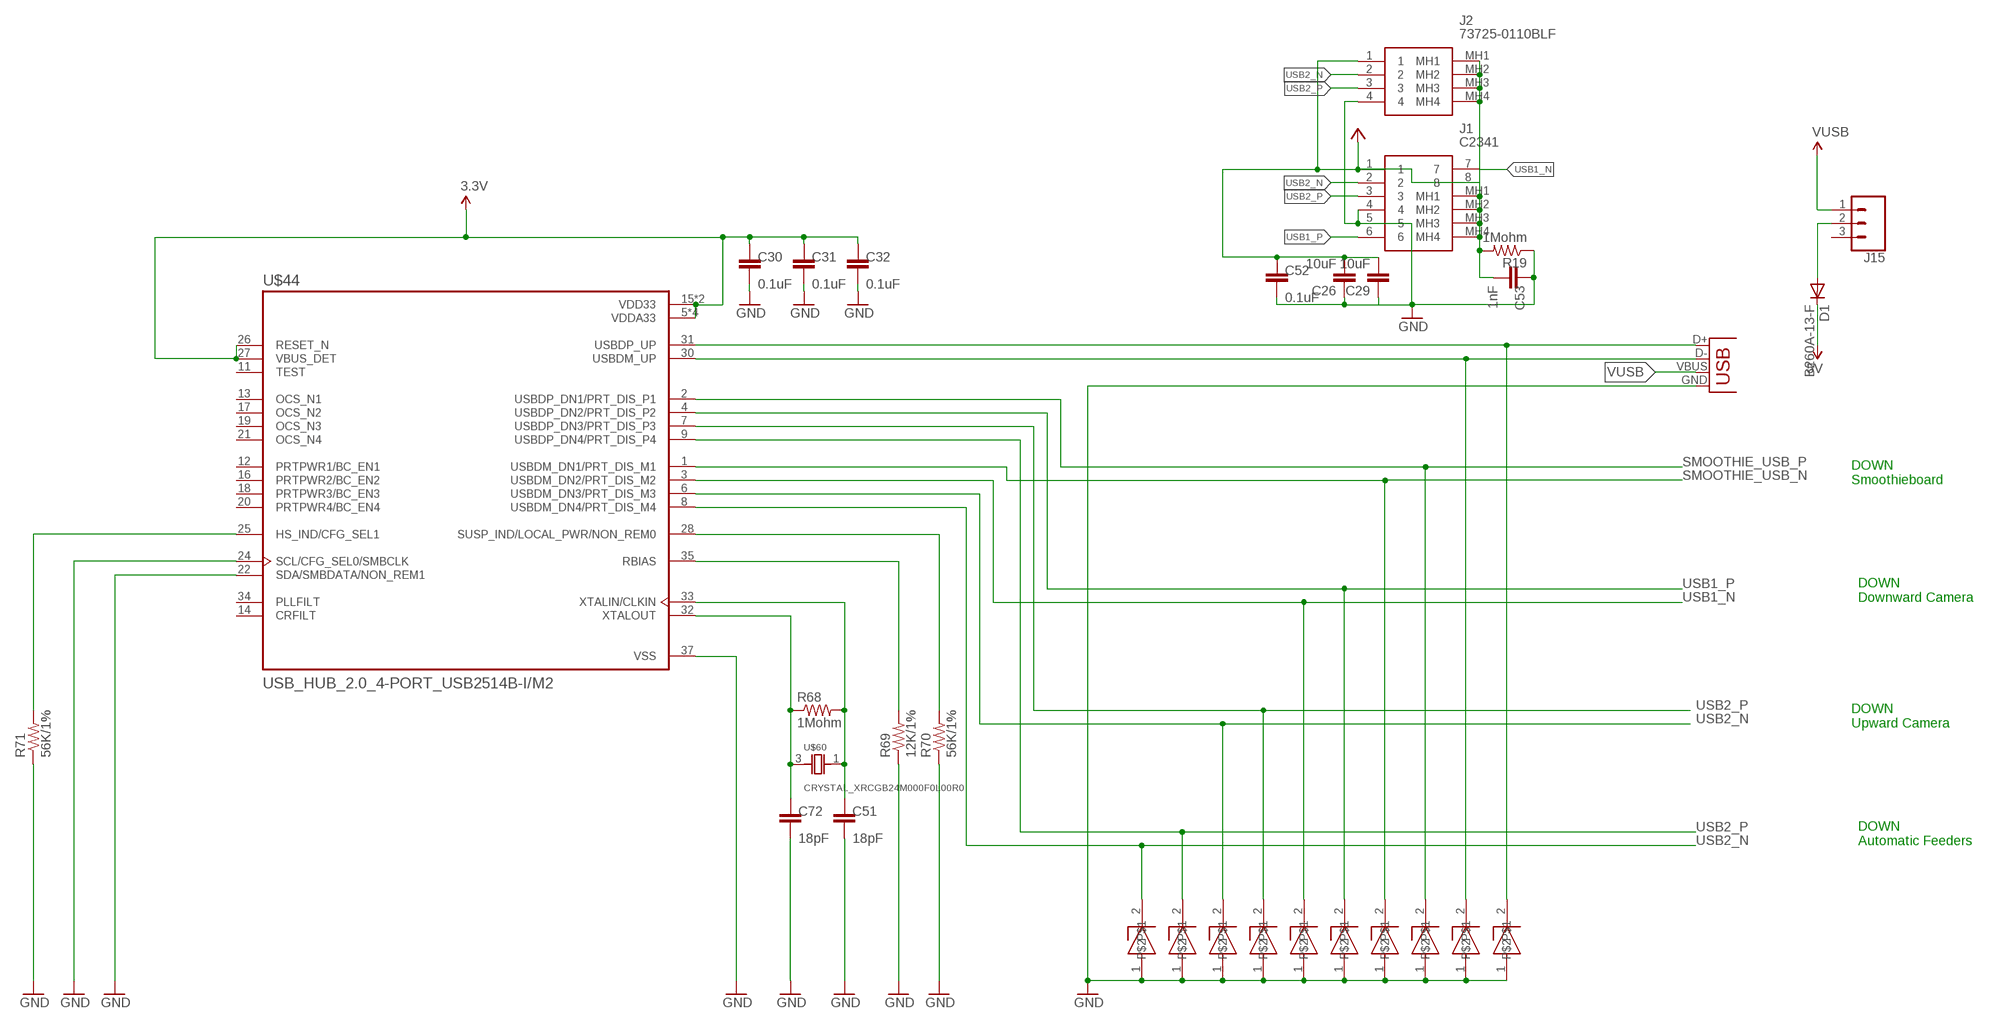
[diagram p7: schematic, sheet 7]

### Parts
C26  10uF  C-EUC0805  [C0805]
C29  10uF  C-EUC0805  [C0805]
C30  0.1uF  CAP_0603  [CAP_0603]
C31  0.1uF  CAP_0603  [CAP_0603]
C32  0.1uF  CAP_0603  [CAP_0603]
C51  18pF  CAP_0603  [CAP_0603]
C52  0.1uF  CAP_0603  [CAP_0603]
C53  1nF  CAP_0603  [CAP_0603]
C72  18pF  CAP_0603  [CAP_0603]
D1  B260A-13-F  DIODE-DO-214AC  [DO-214AC]
J1  C2341  [C2341]
J2  73725-0110BLF  [737250110BLF]
J15  CONN_03  [1X03]
R19  1Mohm  RESISTOR_0603  [RESISTOR_0603]
R68  1Mohm  RESISTOR_0603  [RESISTOR_0603]
R69  12K/1%  RESISTOR_0603  [RESISTOR_0603]
R70  56K/1%  RESISTOR_0603  [RESISTOR_0603]
R71  56K/1%  RESISTOR_0603  [RESISTOR_0603]
U$11  USB-B-PTH  [USB-B-PTH]
U$14  DIODE_ESD_ESD9B3.3ST5G  [DIODE_ESD_ESD9B3.3ST5G]
U$15  DIODE_ESD_ESD9B3.3ST5G  [DIODE_ESD_ESD9B3.3ST5G]
U$18  DIODE_ESD_ESD9B3.3ST5G  [DIODE_ESD_ESD9B3.3ST5G]
U$19  DIODE_ESD_ESD9B3.3ST5G  [DIODE_ESD_ESD9B3.3ST5G]
U$44  USB_HUB_2.0_4-PORT_USB2514B-I/M2  [USB_HUB_2.0_4-PORT_USB2514B-I/M2]
U$50  DIODE_ESD_ESD9B3.3ST5G  [DIODE_ESD_ESD9B3.3ST5G]
U$51  DIODE_ESD_ESD9B3.3ST5G  [DIODE_ESD_ESD9B3.3ST5G]
U$56  DIODE_ESD_ESD9B3.3ST5G  [DIODE_ESD_ESD9B3.3ST5G]
U$57  DIODE_ESD_ESD9B3.3ST5G  [DIODE_ESD_ESD9B3.3ST5G]
U$58  DIODE_ESD_ESD9B3.3ST5G  [DIODE_ESD_ESD9B3.3ST5G]
U$59  DIODE_ESD_ESD9B3.3ST5G  [DIODE_ESD_ESD9B3.3ST5G]
U$60  CRYSTAL_XRCGB24M000F0L00R0  [CRYSTAL_XRCGB24M000F0L00R0]

### Nets
3.3V: C30.1 C31.1 C32.1 U$44.5(VDDA33) U$44.10(VDDA33) U$44.15(VDD33) U$44.23(VDD33) U$44.26(RESET_N) U$44.27(VBUS_DET) U$44.29(VDDA33) U$44.36(VDDA33) ; also sheet 1,2,3,5,6
5V: C26.2 C29.2 C52.1 D1.1(C) J1.1 J1.8 J2.1 ; supply symbol labelled +5V ; also sheet 1,2,3,4,6,8
5VUSB: D1.2(A) J15.2
D5_N [DP/DM]: U$11.D- U$44.30(USBDM_UP) U$58.2
D5_P [DP/DM]: U$11.D+ U$44.31(USBDP_UP) U$59.2
GND: C26.1 C29.1 C30.2 C31.2 C32.2 C51.2 C52.2 C53.1 C72.2 J1.4 J1.5 J2.4 R19.1 R69.1 R70.1 R71.1 U$11.GND U$14.1 U$15.1 U$18.1 U$19.1 U$44.22(SDA/SMBDATA/NON_REM1) U$44.24(SCL/CFG_SEL0/SMBCLK) U$44.37(VSS) U$50.1 U$51.1 U$56.1 U$57.1 U$58.1 U$59.1 ; also sheet 1,2,3,4,5,6,8
N$6: C53.2 J1.MH1 J1.MH2 J1.MH3 J1.MH4 J2.MH1 J2.MH2 J2.MH3 J2.MH4 R19.2
N$33: C51.1 R68.2 U$44.33(XTALIN/CLKIN) U$60.1
N$35: C72.1 R68.1 U$44.32(XTALOUT) U$60.3
N$36: R69.2 U$44.35(RBIAS)
N$37: R70.2 U$44.28(SUSP_IND/LOCAL_PWR/NON_REM0)
N$38: R71.2 U$44.25(HS_IND/CFG_SEL1)
SMOOTHIE_USB_N [DP/DM]: U$44.1(USBDM_DN1/PRT_DIS_M1) U$56.2 ; also sheet 1
SMOOTHIE_USB_P [DP/DM]: U$44.2(USBDP_DN1/PRT_DIS_P1) U$57.2 ; also sheet 1
USB1_N [DP/DM]: J1.7 U$18.2 U$44.3(USBDM_DN2/PRT_DIS_M2)
USB1_P [DP/DM]: J1.6 U$19.2 U$44.4(USBDP_DN2/PRT_DIS_P2)
USB2_N [DP/DM]: J1.2 J2.2 U$14.2 U$44.6(USBDM_DN3/PRT_DIS_M3) U$44.8(USBDM_DN4/PRT_DIS_M4) U$50.2
USB2_P [DP/DM]: J1.3 J2.3 U$15.2 U$44.7(USBDP_DN3/PRT_DIS_P3) U$44.9(USBDP_DN4/PRT_DIS_P4) U$51.2
VUSB: J15.1 U$11.VBUS
Unconnected: J15.3 U$44.11(TEST) U$44.12(PRTPWR1/BC_EN1) U$44.13(OCS_N1) U$44.14(CRFILT) U$44.16(PRTPWR2/BC_EN2) U$44.17(OCS_N2) U$44.18(PRTPWR3/BC_EN3) U$44.19(OCS_N3) U$44.20(PRTPWR4/BC_EN4) U$44.21(OCS_N4) U$44.34(PLLFILT)

### Notes on the sheet
- DOWN
  Smoothieboard
- DOWN
  Downward Camera
- DOWN
  Upward Camera
- DOWN
  Automatic Feeders

## Sheet 8 of 8: Conveyer
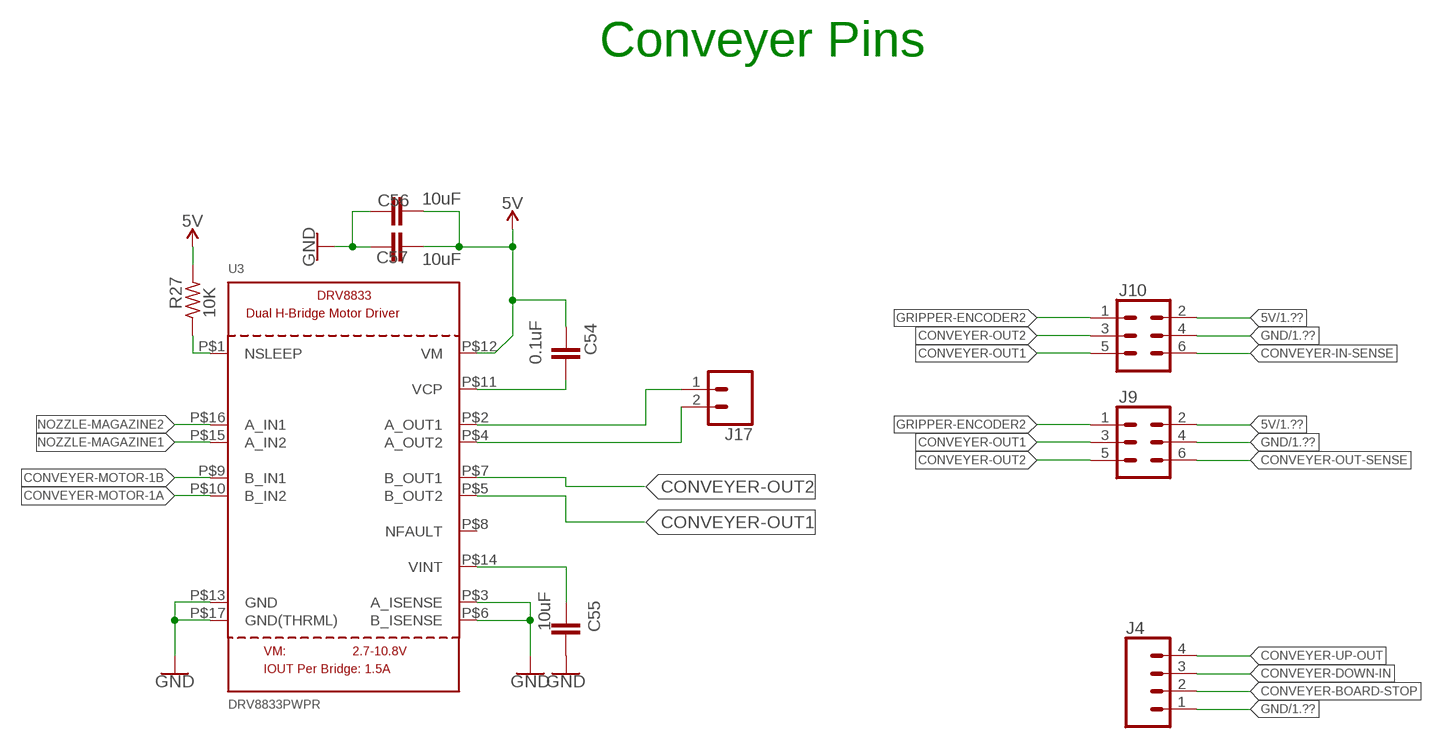
[diagram p8: schematic, sheet 8]

### Parts
C54  0.1uF  CAP_0603  [CAP_0603]
C55  10uF  C-EUC0805  [C0805]
C56  10uF  C-EUC0805  [C0805]
C57  10uF  C-EUC0805  [C0805]
J4  CONN_04  [1X04]
J9  CONN_03X22X3_SILK_MALE_PTH  [2X3]
J10  CONN_03X22X3_SILK_MALE_PTH  [2X3]
J17  CONN_02  [1X02]
R27  10K  RESISTOR_0603  [RESISTOR_0603]
U3  DRV8833PWPR  DRV8833V2  [DRV8833]

### Nets
5V: C54.1 C56.1 C57.1 J9.2 J10.2 R27.2 U3.P$12(VM) ; also sheet 1,2,3,4,6,7
!SLEEP: R27.1 U3.P$1(NSLEEP)
CONVEYER-BOARD-STOP: J4.2 ; also sheet 1
CONVEYER-DOWN-IN: J4.3 ; also sheet 1
CONVEYER-IN-SENSE: J10.6 ; also sheet 1
CONVEYER-MOTOR-1A: U3.P$10(B_IN2) ; also sheet 1
CONVEYER-MOTOR-1B: U3.P$9(B_IN1) ; also sheet 1
CONVEYER-OUT1: J9.3 J10.5 U3.P$5(B_OUT2)
CONVEYER-OUT2: J9.5 J10.3 U3.P$7(B_OUT1)
CONVEYER-OUT-SENSE: J9.6 ; also sheet 1
CONVEYER-UP-OUT: J4.4 ; also sheet 1
GND: C55.2 C56.2 C57.2 J4.1 J9.4 J10.4 U3.P$3(A_ISENSE) U3.P$6(B_ISENSE) U3.P$13(GND) U3.P$17(GND(THRML)) ; also sheet 1,2,3,4,5,6,7
GRIPPER-ENCODER2: J9.1 J10.1 ; also sheet 1
N$5: C54.2 U3.P$11(VCP)
N$22: C55.1 U3.P$14(VINT)
N$56: J17.2 U3.P$4(A_OUT2)
N$57: J17.1 U3.P$2(A_OUT1)
NOZZLE-MAGAZINE1: U3.P$15(A_IN2) ; also sheet 1
NOZZLE-MAGAZINE2: U3.P$16(A_IN1)
Unconnected: U3.P$8(NFAULT)

### Notes on the sheet
- Conveyer Pins

## Library data of the parts
22UH = Inductors-Griff:L_: INDUCTOR
C1 C13 C15 C23 C33 C34 C40 C41 = rcl:CPOL-EU: POLARIZED CAPACITOR, European symbol; SPICEPREFIX: C
C2-C12 C14 C16-C18 C20 C27 C28 C30-C32 C35-C39 C45 C46 C48-C54 C58-C64 C66-C73 C75-C81 C89-C94 C103-C108 LADC = Shai-Parts:CAP_0603
C22 C24-C26 C29 C47 C55-C57 C65 C74 C88 C102 = rcl:C-EU: CAPACITOR, European symbol; SPICEPREFIX: C
C85 C86 = Shai-Parts:CAP_ARRAY_CA064C104M4RAC7800; BUILT_BY: EMA_UL_Team; MANUFACTURER_PART_NUMBER: CA064C104M4RAC7800; SOURCELIBRARY: Kemet_2015-04-15; VENDOR: KEMET
D1 D3 D4 = dp_devices:DIODE: Various Diode Packages
D2 D5-D11 = SparkFun-DiscreteSemi:DIODE: Diode These are standard reverse protection diodes and small signal diodes. SparkFun Products: SparkFun SparkPunk Sound Kit <https://www.sparkfun.com/products/11177> SparkFun ESP8266 Thing <https://www.sparkfun.com/products/13231>; PROD_ID: DIO-09646; VALUE: 250mA/100V
IC1 = Shai-Parts:LPC1769
IC2 IC4 IC6 IC7 IC10 IC12 = we-chip:TMC2208: Trinamic TMC2108 Stepper Motor Driver (5V...36V, 1.2A RMS, 256 microsteps)
IC5 IC8 = Geos:MCP44X1: MCP44x1 MCP4451 - ? Quad Resistor Network ? I2C Serial Interface Support ? Potentiometer or Rheostat Configuration Options ? Resistor Network Resolution: 7-bit ? 128 Resistors (129 Taps) 8-bit ? 256 Resistors (257 Taps)
J1 = samacsys:C2341: USB Connectors Plugin RoHS Source: Datasheet <https://datasheet.lcsc.com/szlcsc/Jing-Extension-of-the-Electronic-Co-LCSC-USB-A-F-Double-layer-DIP-900-Iron-shell-white-Not-high-temperature_C2341.pdf>; DESCRIPTION: USB Connectors Plugin RoHS; HEIGHT: 15.9mm; MANUFACTURER_NAME: Jing Extension of the Electronic Co.; MANUFACTURER_PART_NUMBER: C2341
J2 = samacsys:73725-0110BLF: USB Connectors USB UP RIGHT RECEP W/O SENSOR FLAG Source: Datasheet <https://www.mouser.com/datasheet/2/18/73725-1363325.pdf>; ARROW_PART_NUMBER: 73725-0110BLF; ARROW_PRICE-STOCK: https://www.arrow.com/en/products/73725-0110blf/amphenol-fci; DESCRIPTION: USB Connectors USB UP RIGHT RECEP W/O SENSOR FLAG; HEIGHT: 14.03mm; MANUFACTURER_NAME: Amphenol; MANUFACTURER_PART_NUMBER: 73725-0110BLF; MOUSER_PART_NUMBER: 649-73725-0110BLF; MOUSER_PRICE-STOCK: https://www.mouser.co.uk/ProductDetail/Amphenol-FCI/73725-0110BLF?qs=x6EjVpvqMVP%252BaDTVID3rTA%3D%3D
J3 J4 J7 J8 = SparkFun-Connectors:CONN_04: Multi connection point. Often used as Generic Header-pin footprint for 0.1 inch spaced/style header connections On any of the 0.1 inch spaced packages, you can populate with these: Break Away Headers - Straight <https://www.sparkfun.com/products/116> (PRT-00116) Break Away Male Headers - Right Angle <https://www.sparkfun.com/products/553> (PRT-00553) Female Headers <https://www.sparkfun.com/products/115> (PRT-00115) Break Away Headers - Machine Pin <https://www.sparkfun.com/products/117> (PRT-00117) Break Away Female Headers - Swiss Machine Pin <https://www.sparkfun.com/products/743> (PRT-00743) For SCREWTERMINALS and SPRING TERMINALS visit here: Screw Terimnals on SparkFun.com <https://www.sparkfun.com/search/results?term=Screw+Terminals> (5mm/3.5mm/2.54mm spacing) This device is also useful as a general connection point to wire up your design to another part of your project. Our various solder wires solder well into these plated through hole pads. Hook-Up Wire - Assortment (Stranded, 22 AWG) <https://www.sparkfun.com/products/11375> (PRT-11375) Hook-Up Wire - Assortment (Solid Core, 22 AWG) <https://www.sparkfun.com/products/11367> (PRT-11367) View the entire wire category on our website here <https://www.sparkfun.com/categories/141> Special notes: Molex polarized connector foot print use with SKU : PRT-08231 with associated crimp pins and housings. 1MM SMD Version SKU: PRT-10208; PROD_ID: CONN-09696
J5 = SparkFun-Connectors:CONN_05X2: Multi connection point. Often used as Generic Header-pin footprint for 0.1 inch spaced/style header connections For AVR SPI programming port, see special device with nice symbol: "AVR_SPI_PROG_5x2.dev" You can populate with any combo of single row headers, but if you'd like an exact match, check these: 2x5 AVR ICSP Male Header <https://www.sparkfun.com/products/778> (PRT-00778) 2x5 Pin Shrouded Header <https://www.sparkfun.com/products/8506> (PRT-08506) On any of the 0.1 inch spaced packages, you can populate with these: Break Away Headers - Straight <https://www.sparkfun.com/products/116> (PRT-00116) Break Away Male Headers - Right Angle <https://www.sparkfun.com/products/553> (PRT-00553) Female Headers <https://www.sparkfun.com/products/115> (PRT-00115) Break Away Headers - Machine Pin <https://www.sparkfun.com/products/117> (PRT-00117) Break Away Female Headers - Swiss Machine Pin <https://www.sparkfun.com/products/743> (PRT-00743) Special note: the shrouded connector mates well with our 5x2 ribbon cables: 2x5 Pin IDC Ribbon Cable <https://www.sparkfun.com/products/8535> (PRT-08535); PROD_ID: CONN-08499; SF_ID: PRT-0778
J6 J11 = SparkFun-Connectors:CONN_04X2: Multi connection point. Often used as Generic Header-pin footprint for 0.1 inch spaced/style header connections On any of the 0.1 inch spaced packages, you can populate with these: Break Away Headers - Straight <https://www.sparkfun.com/products/116> (PRT-00116) Break Away Male Headers - Right Angle <https://www.sparkfun.com/products/553> (PRT-00553) Female Headers <https://www.sparkfun.com/products/115> (PRT-00115) Break Away Headers - Machine Pin <https://www.sparkfun.com/products/117> (PRT-00117) Break Away Female Headers - Swiss Machine Pin <https://www.sparkfun.com/products/743> (PRT-00743)
J9 J10 = SparkFun-Connectors:CONN_03X2: Multi connection point. Often used as Generic Header-pin footprint for 0.1 inch spaced/style header connections You can populate with any combo of single row headers, but if you'd like an exact match, check these: Header - 2x3 (Male, 0.1") <https://www.sparkfun.com/products/12807> (PRT-12807) Header - 2x3 (Female, 0.1") <https://www.sparkfun.com/products/13010> (PRT-13010) 2x3 Pin Shrouded Header <https://www.sparkfun.com/products/10877> (PRT-10877) On any of the 0.1 inch spaced packages, you can populate with these: Break Away Headers - Straight <https://www.sparkfun.com/products/116> (PRT-00116) Break Away Male Headers - Right Angle <https://www.sparkfun.com/products/553> (PRT-00553) Female Headers <https://www.sparkfun.com/products/115> (PRT-00115) Break Away Headers - Machine Pin <https://www.sparkfun.com/products/117> (PRT-00117) Break Away Female Headers - Swiss Machine Pin <https://www.sparkfun.com/products/743> (PRT-00743) Special note: the shrouded connector mates well with our 3x2 ribbon cables: Ribbon Crimp Connector - 6-pin (2x3, Female) <https://www.sparkfun.com/products/10651> (PRT-10651) Ribbon Cable - 6 wire (15ft) <https://www.sparkfun.com/products/10646> (PRT-10646); PROD_ID: CONN-09701
J12 = SparkFun-Connectors:CONN_03X2: Multi connection point. Often used as Generic Header-pin footprint for 0.1 inch spaced/style header connections You can populate with any combo of single row headers, but if you'd like an exact match, check these: Header - 2x3 (Male, 0.1") <https://www.sparkfun.com/products/12807> (PRT-12807) Header - 2x3 (Female, 0.1") <https://www.sparkfun.com/products/13010> (PRT-13010) 2x3 Pin Shrouded Header <https://www.sparkfun.com/products/10877> (PRT-10877) On any of the 0.1 inch spaced packages, you can populate with these: Break Away Headers - Straight <https://www.sparkfun.com/products/116> (PRT-00116) Break Away Male Headers - Right Angle <https://www.sparkfun.com/products/553> (PRT-00553) Female Headers <https://www.sparkfun.com/products/115> (PRT-00115) Break Away Headers - Machine Pin <https://www.sparkfun.com/products/117> (PRT-00117) Break Away Female Headers - Swiss Machine Pin <https://www.sparkfun.com/products/743> (PRT-00743) Special note: the shrouded connector mates well with our 3x2 ribbon cables: Ribbon Crimp Connector - 6-pin (2x3, Female) <https://www.sparkfun.com/products/10651> (PRT-10651) Ribbon Cable - 6 wire (15ft) <https://www.sparkfun.com/products/10646> (PRT-10646); PROD_ID: CONN-11566
J13 = SparkFun-Connectors:CONN_06X2: Multi connection point. Often used as Generic Header-pin footprint for 0.1 inch spaced/style header connections On any of the 0.1 inch spaced packages, you can populate with these: Break Away Headers - Straight <https://www.sparkfun.com/products/116> (PRT-00116) Break Away Male Headers - Right Angle <https://www.sparkfun.com/products/553> (PRT-00553) Female Headers <https://www.sparkfun.com/products/115> (PRT-00115) Break Away Headers - Machine Pin <https://www.sparkfun.com/products/117> (PRT-00117) Break Away Female Headers - Swiss Machine Pin <https://www.sparkfun.com/products/743> (PRT-00743); PROD_ID: CONN-12423
J14 J17 = SparkFun-Connectors:CONN_02: Multi connection point. Often used as Generic Header-pin footprint for 0.1 inch spaced/style header connections On any of the 0.1 inch spaced packages, you can populate with these: Break Away Headers - Straight <https://www.sparkfun.com/products/116> (PRT-00116) Break Away Male Headers - Right Angle <https://www.sparkfun.com/products/553> (PRT-00553) Female Headers <https://www.sparkfun.com/products/115> (PRT-00115) Break Away Headers - Machine Pin <https://www.sparkfun.com/products/117> (PRT-00117) Break Away Female Headers - Swiss Machine Pin <https://www.sparkfun.com/products/743> (PRT-00743) For SCREWTERMINALS and SPRING TERMINALS visit here: Screw Terimnals on SparkFun.com <https://www.sparkfun.com/search/results?term=Screw+Terminals> (5mm/3.5mm/2.54mm spacing) This device is also useful as a general connection point to wire up your design to another part of your project. Our various solder wires solder well into these plated through hole pads. Hook-Up Wire - Assortment (Stranded, 22 AWG) <https://www.sparkfun.com/products/11375> (PRT-11375) Hook-Up Wire - Assortment (Solid Core, 22 AWG) <https://www.sparkfun.com/products/11367> (PRT-11367) View the entire wire category on our website here <https://www.sparkfun.com/categories/141> Special notes: Molex polarized connector foot print use with: PRT-08233 with associated crimp pins and housings. 2.54_SCREWTERM for use with PRT-10571. 3.5mm Screw Terminal footprints for PRT-08084 5mm Screw Terminal footprints for use with PRT-08432
J15 = SparkFun-Connectors:CONN_03: Multi connection point. Often used as Generic Header-pin footprint for 0.1 inch spaced/style header connections On any of the 0.1 inch spaced packages, you can populate with these: Break Away Headers - Straight <https://www.sparkfun.com/products/116> (PRT-00116) Break Away Male Headers - Right Angle <https://www.sparkfun.com/products/553> (PRT-00553) Female Headers <https://www.sparkfun.com/products/115> (PRT-00115) Break Away Headers - Machine Pin <https://www.sparkfun.com/products/117> (PRT-00117) Break Away Female Headers - Swiss Machine Pin <https://www.sparkfun.com/products/743> (PRT-00743) Stackable Header - 3 Pin (Female, 0.1") <https://www.sparkfun.com/products/13875> (PRT-13875) For SCREWTERMINALS and SPRING TERMINALS visit here: Screw Terimnals on SparkFun.com <https://www.sparkfun.com/search/results?term=Screw+Terminals> (5mm/3.5mm/2.54mm spacing) This device is also useful as a general connection point to wire up your design to another part of your project. Our various solder wires solder well into these plated through hole pads. Hook-Up Wire - Assortment (Stranded, 22 AWG) <https://www.sparkfun.com/products/11375> (PRT-11375) Hook-Up Wire - Assortment (Solid Core, 22 AWG) <https://www.sparkfun.com/products/11367> (PRT-11367) View the entire wire category on our website here <https://www.sparkfun.com/categories/141> Special notes: Molex polarized connector foot print use with SKU : PRT-08232 with associated crimp pins and housings.
J16 = Wurth_Connectors_WR-TBL Wire Protector:691137710004: WR-TBL Serie 1377 - 5.00 mm Horiz Entry w. Pressure Clamp Glow Wire KIND PROPERTIES Pitch 5 mm MATERIAL PROPERTIES Insulator Material PA6/66 Insulator Flammability Rating UL94 V-0 Insulator Color Green Contact Material Copper Alloy Contact Plating Tin over Nickel Terminal Screw Material Steel Terminal Screw Plating Zinc Wire Guard Material Copper Alloy with Tin GENERAL INFORMATION Operating Temperature -30 up to +120 °C Compliance Lead free / RoHS ELECTRICAL PROPERTIES IR UL 16 A IR VDE 24 A Working Voltage [UL] 300 V (AC) Working Voltage [VDE] 250 V (AC) Withstanding Voltage [UL] 1600 V (AC) Withstanding Voltage [VDE] 2000 V (AC) Contact Resistance 20 mΩ Contact Resistance [UL] 20 mΩ Contact Resistance [VDE] 20 mΩ MECHANICAL PROPERTIES Wire Strip Length 6 (mm) Screw M2.5 Solid Wire Section (AWG) 12 to 30 (AWG) Solid Wire Section (Metric) 3.31 to 0.05 (mm²) Stranded Wire Section (AWG) 12 to 30 (AWG) Stranded Wire Section (Metric) 3.31 to 0.05 (mm²) CERTIFICATION UL Approval E150931 VDE Approval 40021397 PACKAGING PROPERTIES Packaging Box <https://katalog.we-online.com/media/images/v2/o84014v209%20Family_WR-TBL1_6911377100xx.jpg> Details see: https://katalog.we-online.com/en/em/TBL_5_00_1377_HORIZONTAL_ENTRY_W_PRESSURE_CLAMP_GLOW_WIRE_6911377100xx Updated by Ella Wu 2019-11-08 2019(C) Wurth Elektronik; DATASHEET-URL: https://www.we-online.com/catalog/datasheet/691137710004.pdf; IR-UL: 16A; IR-VDE: 24A; MOUNT: THT; PART-NUMBER: 691137710004; PINS: 4; PITCH: 5mm; TYPE: Horizontal; WIRE: 12 to 30 (AWG) 3.31 to 0.05 (mm²); WORKING-VOLTAGE-UL: 300V(AC); WORKING-VOLTAGE-VDE: 250V(AC)
L1 = SparkFun-LED:LED-GREEN: Green SMD LED Used in manufacturing of various products at SparkFun Packages: 0603 - SMD 0603 package [Product Link] <http://www.futureelectronics.com/en/technologies/semiconductors/optoelectronics/leds/Pages/9894312-LTST-C190GKT.aspx?CrossPart=HSMG-C190&IM=0> LilyPad 1206 - SMD1206 LilyPad package [Product Link] <http://www.futureelectronics.com/en/Technologies/Product.aspx?ProductID=IN150NGHARVATEKCORPORATION2049943&IM=0> 1206 - SMD1206 package [Product Link] <http://www.futureelectronics.com/en/technologies/semiconductors/optoelectronics/leds/Pages/8315665-LTST-C150KGKT.aspx?IM=0> 1206 Bottom Mount -SMD 1206 Bottom Mount [Product Link] <http://www.digikey.com/product-detail/en/lite-on-inc/LTST-C230KGKT/160-1456-1-ND/386854> SparkFun Products: Pro Mini 328 -5V <https://www.sparkfun.com/products/821> RedBoard <https://www.sparkfun.com/products/12757> MP3 Trigger <https://www.sparkfun.com/products/13720> Makey Makey <https://www.sparkfun.com/products/11076>; PROD_ID: DIO-00821
L2 L3 LED10 SD = SparkFun-LED:LED: LED (Generic) Standard schematic elements and footprints for 5mm, 3mm, 1206, and 0603 sized LEDs. Generic LEDs with no color specified.
Q1 = transistor-fet:BSL207SP: OptiMOS(R)-P Small-Signal-Transistor P-Channel, Enhancement mode, Super Logic Level (2.5 V rated) Source: http://www.infineon.com/upload/Document/BSL207SP_Rev2.01.pdf
Q2 = microbuilder:CRYSTAL: Crystals HC49UP - Surface Mount Crystal 4.0MHz 18pF +/-30ppm Surface Mount Crystal [Digikey: 535-9857-1-ND] 12.0 MHz Surface Mount Crystal [Digikey: 535-9869-6-ND] 25.0 MHz Surface Mount Crystal [Digikey: 535-9078-1-ND] 2.5 x 2.0mm - MEMs SMT Crystal 16.0 MHz 10pF 20ppm 2.5 x 2.0mm Crystal [Digikey -40-85°C: 535-10923-1-ND] 3.2 x 2.5mm - MEMs SMT Crystal 12.0 MHz 8pF 15ppm 3.2 x 2.5mm Crystal [Digikey: -10-70°C: 644-1047-1-ND -40-125°C: 644-1128-1-ND] 16.0 MHz 8pF 15ppm 3.2 x 2.5mm Crystal [Digikey: -10-70°C: 644-1049-1-ND -40-125°C: 644-1129-2-ND] 16.0 MHz 10pF 10ppm 3.2 x 2.5mm Crystal [Digikey: 644-1100-1-ND] 27.12 MHz 18pF 30ppm 3.2 x 2.5mm Crystal [Digikey: 887-1424-1-ND] 27.12MHz 10pF 10ppm 3.2 x 2.5mm Crystal [Digikey: 887-1329-1-ND] 4.9 x 1.8mm - MEMs SMT Crystal 32.768 KHz 12.5pF 20ppm 4.9 x 1.8mm Crystal [Digikey: SE2415CT-ND] 8.0 x 3.8mm - Surface Mount Crystal 32.768kHz 12.5pF 20ppm -40°C-85°C [Digikey: 535-9166-2-ND] Cylinder 32.768KHz Cylinder Crystal (2x6mm body) [Ex. Digikey: 300-8341-2-ND]
R1-R3 R5-R9 R11-R34 R36-R38 R40-R43 R46-R50 R52 R53 R55-R73 R78-R81 R90-R93 = Shai-Parts:RESISTOR_0603
R4 R10 R35 R39 R44 R45 R51 R54 R76 R77 R88 R89 = rcl:R-EU_: RESISTOR, European symbol; SPICEPREFIX: R
RN1 = samacsys:YC248-JR-0710KL: YAGEO - YC248-JR-0710KL - RESISTOR ARRAY, 8 RES, 0616, 5%, 10K Source: Datasheet <http://www.yageo.com/documents/recent/PYu-YC248_51_RoHS_L_2.pdf>; ARROW_PART_NUMBER: YC248-JR-0710KL; ARROW_PRICE-STOCK: https://www.arrow.com/en/products/yc248-jr-0710kl/yageo; DESCRIPTION: YAGEO - YC248-JR-0710KL - RESISTOR ARRAY, 8 RES, 0616, 5%, 10K; HEIGHT: 0.55mm; MANUFACTURER_NAME: YAGEO (PHYCOMP); MANUFACTURER_PART_NUMBER: YC248-JR-0710KL; MOUSER_PART_NUMBER: 603-YC248-JR-0710KL; MOUSER_PRICE-STOCK: https://www.mouser.co.uk/ProductDetail/Yageo/YC248-JR-0710KL?qs=8cPjvKtxWv7XgZyJevtvWg%3D%3D
S1 S2 = Shai-Parts:SWITCH_MOMENTARY
SUPPLY10 = SparkFun-PowerSymbols:2PT_GND_TIE: Dual Ground Supply Power supply symbol for connecting two grounds. SparkFun Products: SparkFun AutoDriver - Stepper Motor Driver <https://www.sparkfun.com/products/11611>
U1 U4 = samacsys:3544-2: KEYSTONE - 3544-2 - FUSE HOLDER, 20A Source: Datasheet <http://www.keyelco.com/product-pdf.cfm?p=1376>; ALLIED_NUMBER: 70182237; ALLIED_PRICE-STOCK: https://www.alliedelec.com/keystone-electronics-3544-2/70182237/; DESCRIPTION: KEYSTONE - 3544-2 - FUSE HOLDER, 20A; HEIGHT: mm; MANUFACTURER_NAME: Keystone Electronics; MANUFACTURER_PART_NUMBER: 3544-2; MOUSER_PART_NUMBER: 534-3544-2; MOUSER_PRICE-STOCK: https://www.mouser.com/Search/Refine.aspx?Keyword=534-3544-2
U2 = SparkFun-PowerIC:V_REG_LM1117: Voltage Regulator LM1117 Standard adjustable voltage regulator but in SMD form. Spark Fun Electronics SKU : COM-00595; PROD_ID: VREG-08170
U3 = microbuilder:DRV8833: DRV8833 Dual H-Bridge Motor Driver -- HTSSOP Package
U$1 U$3 U$7 U$21 U$26 U$28 U$29 U$31 U$33 = Shai-Parts:CONNECTORS_MOLEX-1X2
U$2 = griffin components:AOZ1282CI
U$4 U$5 U$16 U$23-U$25 U$35 = Shai-Parts:CONNECTORS_MOLEX-1X4
U$9 U$10 = adafruit:FIDUCIAL: For use by pick and place machines to calibrate the vision/machine, 1mm By microbuilder.eu
U$11 = Shai-Parts:USB-B-PTH
U$12 = Shai-Parts:MICROSD_PUSH-PULL: CONN MICRO SD CARD PUSH-PULL - Digikey # 0473093751
U$13 U$20 U$27 U$30 U$32 U$34 = Shai-Parts:MOSFET_DMN3404L-7
U$14 U$15 U$18 U$19 U$50 U$51 U$56-U$59 = Shai-Parts:DIODE_ESD_ESD9B3.3ST5G
U$22 = Shai-Parts:MOSFET_AON7524
U$44 = Shai-Parts:USB_HUB_2.0_4-PORT_USB2514B-I/M2
U$60 = Shai-Parts:CRYSTAL_XRCGB24M000F0L00R0

## Net classes
1 DP/DM: width 0.203 mm
5 3.3-Amp Class: width 1.27 mm